# Altium project xDAC-v3.PrjPcb (part 4 of 7)

## Sheet TEC_CONTROLLER_1.SchDoc: Laser PCB
size A3; DrawnBy: James Singleton; Organization: TMC Technology Ltd.; DocumentNumber: 11; Revision: A; SheetNumber: 10; SheetTotal: 18; Drawn Date: 22/12/2020
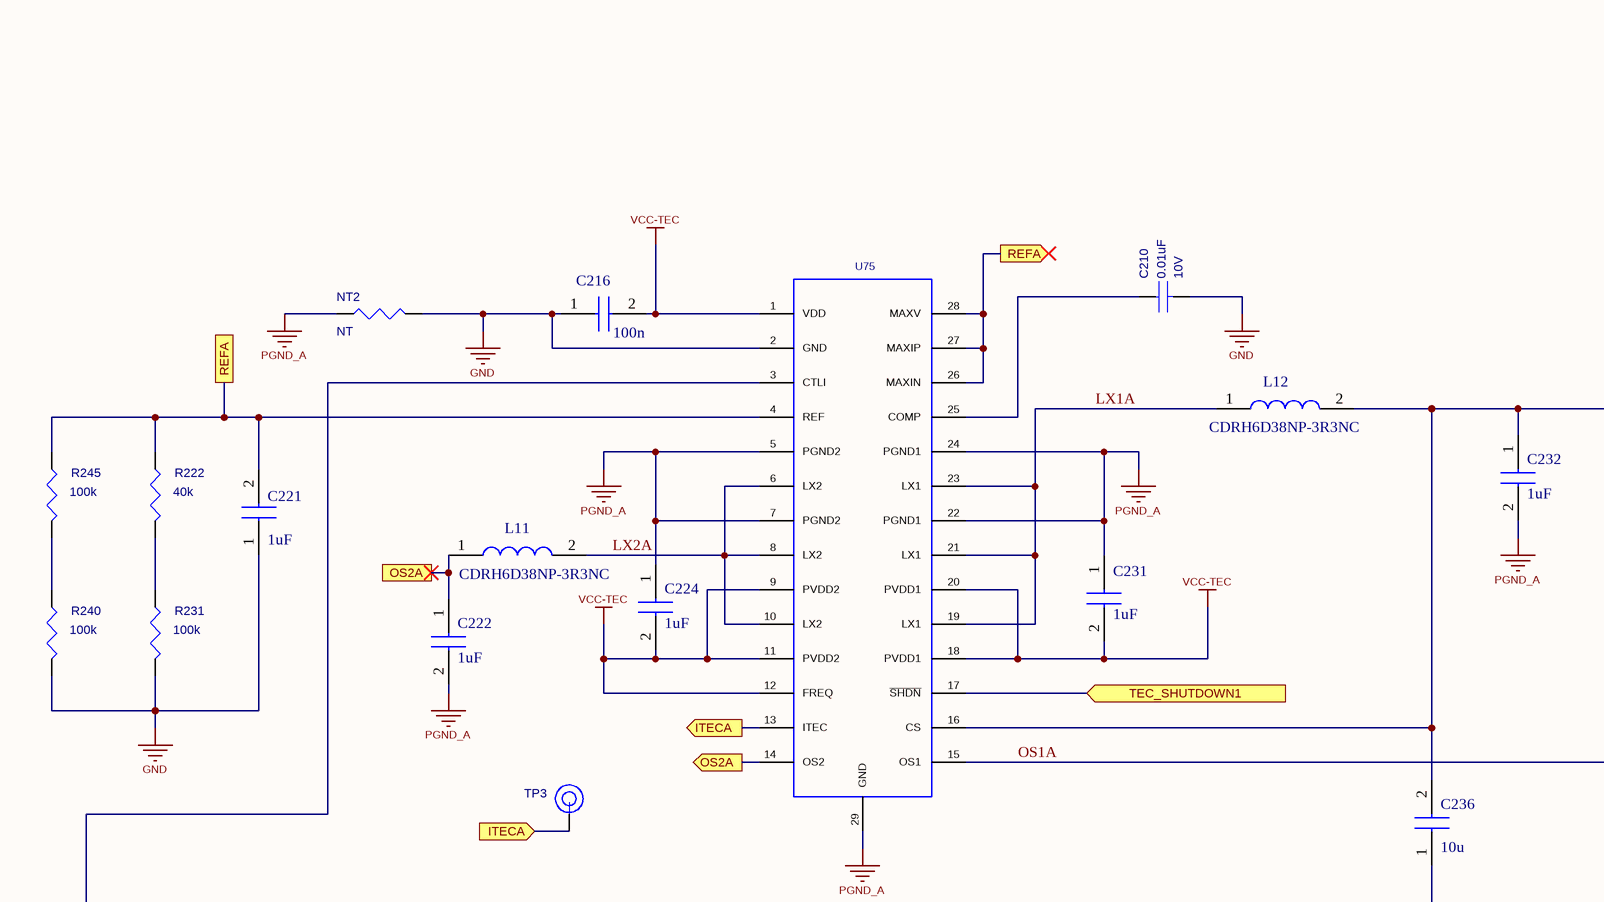
[diagram p11: TEC_CONTROLLER_1.SchDoc, top left]
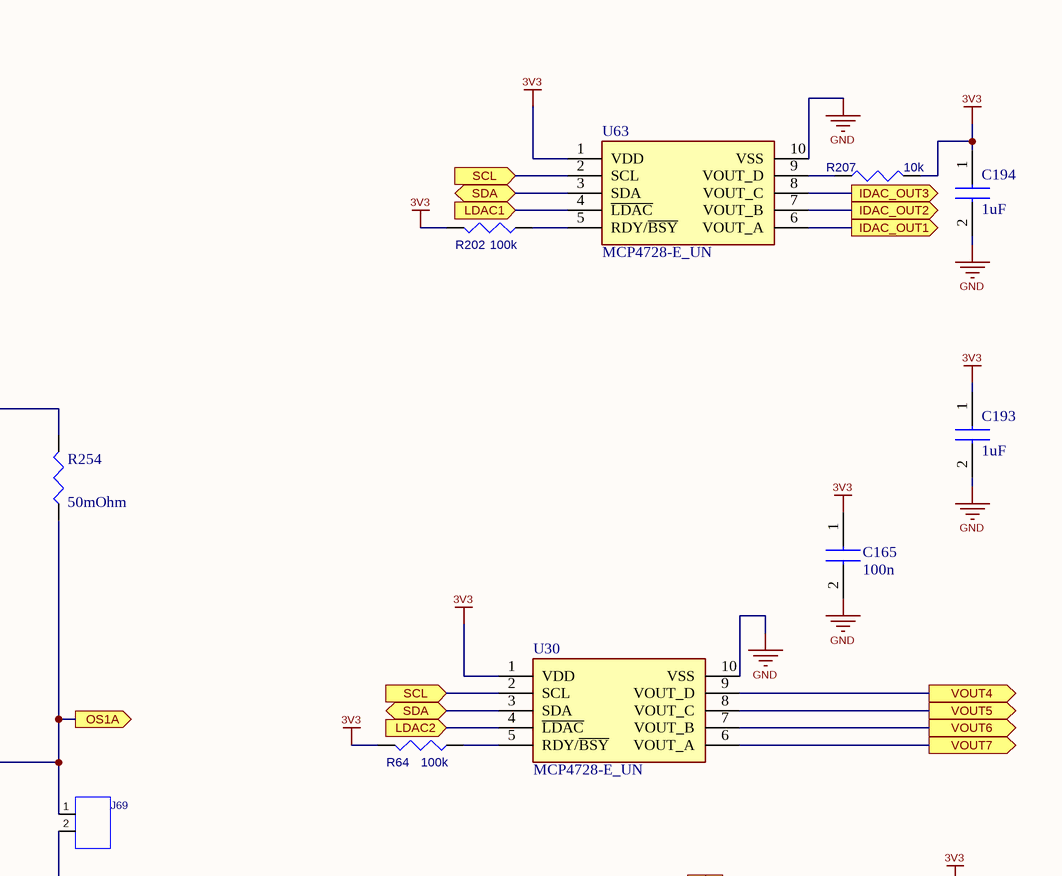
[diagram p12: TEC_CONTROLLER_1.SchDoc, top right]
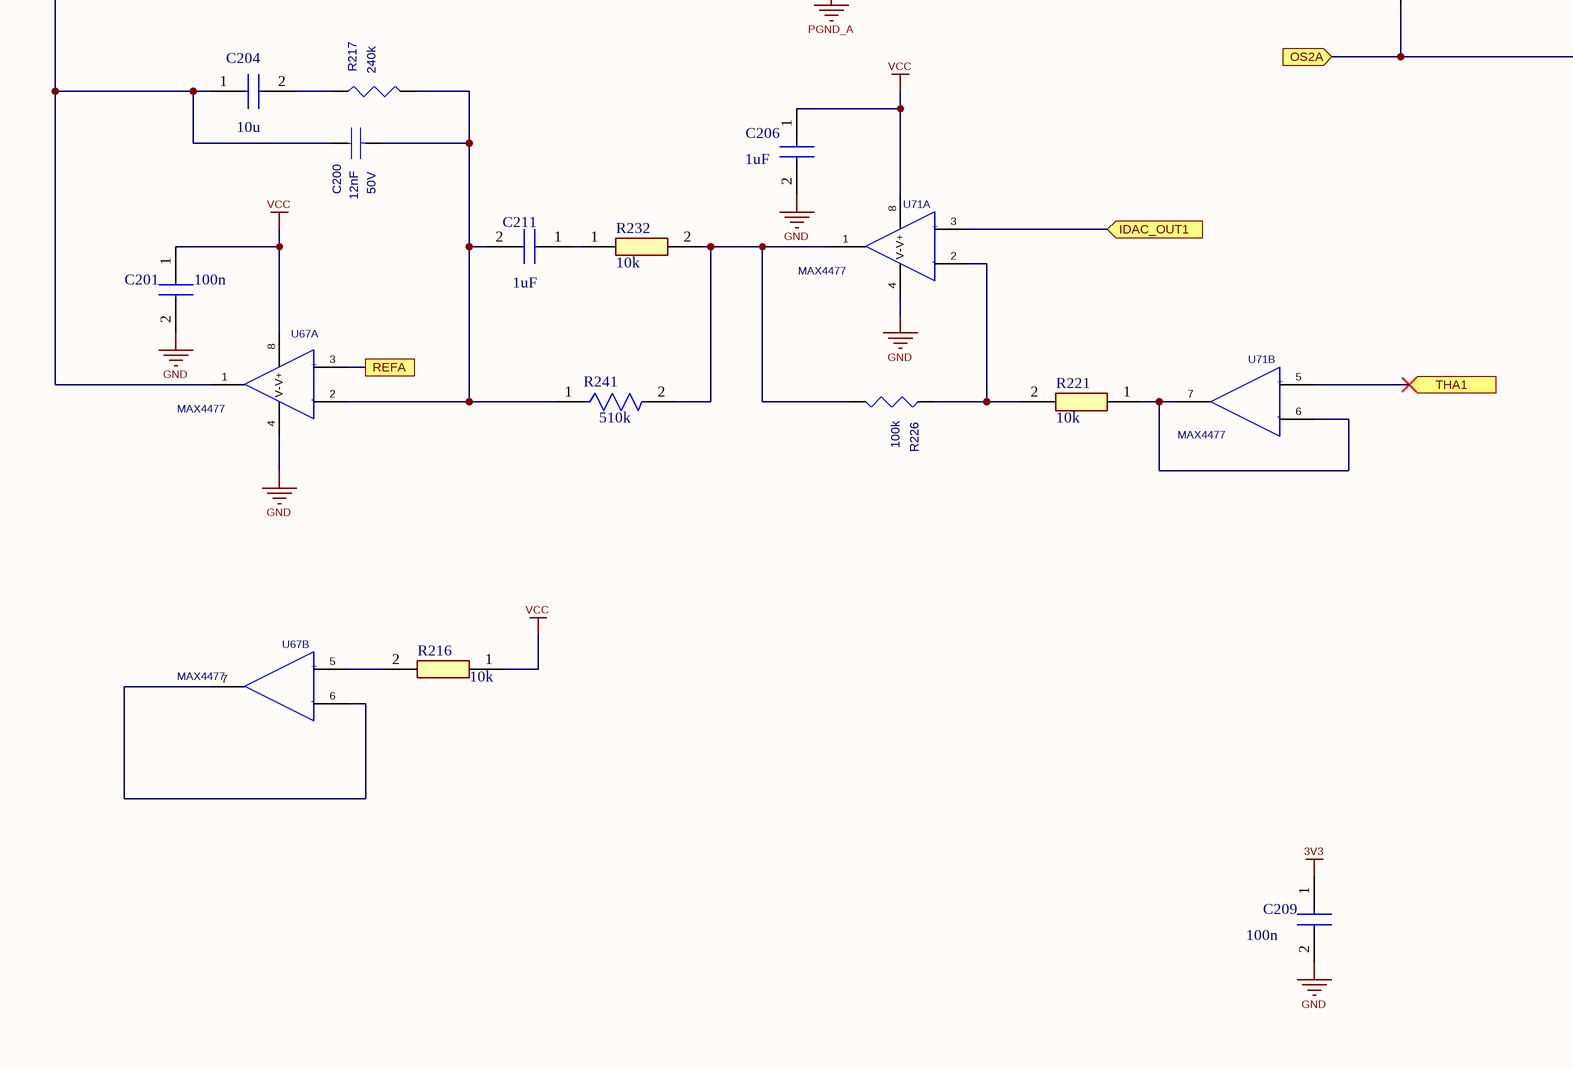
[diagram p13: TEC_CONTROLLER_1.SchDoc, bottom left]
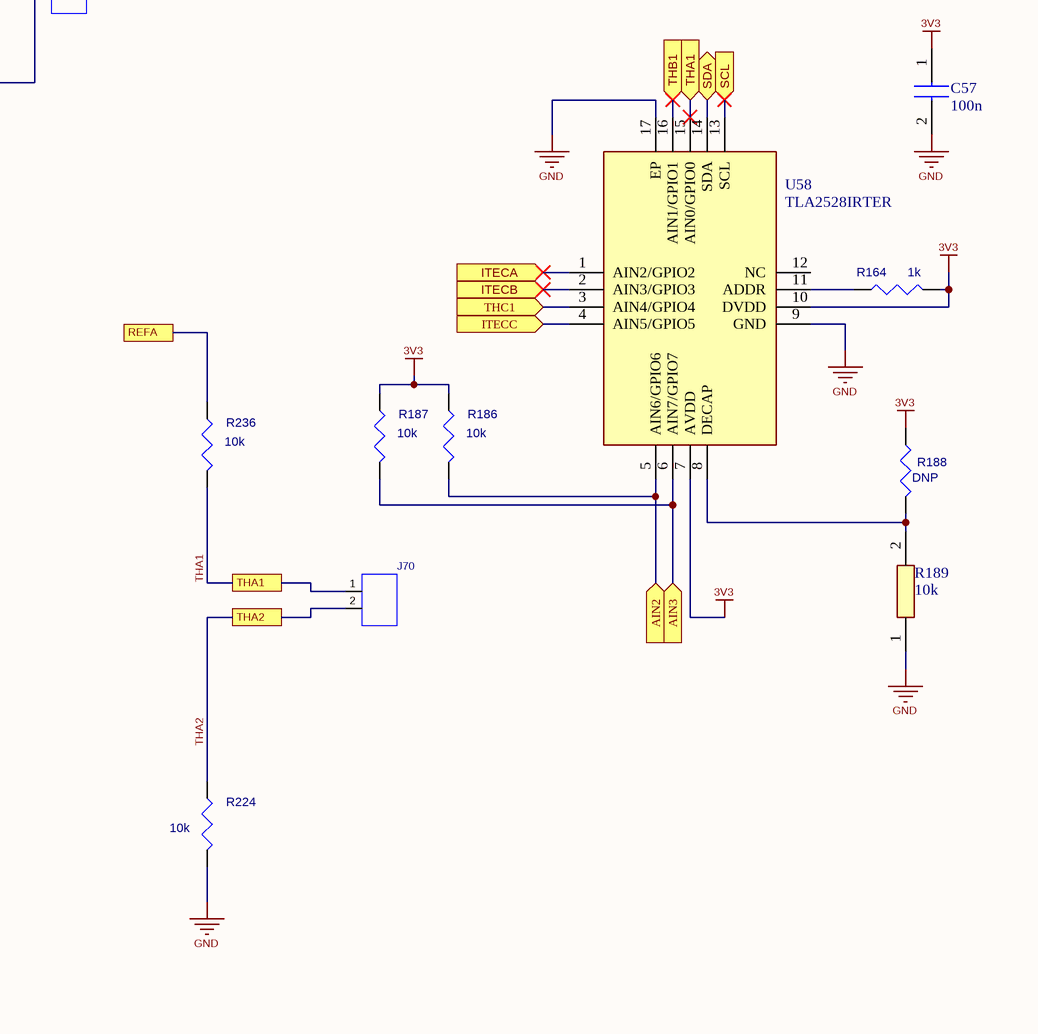
[diagram p14: TEC_CONTROLLER_1.SchDoc, bottom right]

### Parts
C57  100n  [CAPC1608X90N]
C165  100n  [CAPC1608X90N]
C193  1uF  [CAPC1608X95N]
C194  1uF  [CAPC1608X95N]
C200  value 12nF  Rated_Voltage: 50V  [CC0603N]  (hidden comment: 12n)
C201  100n  [CAPC1608X90N]
C204  10u  [CAPC1608X90N]
C206  1uF  [CAPC1608X95N]
C209  100n  [CAPC1608X90N]
C210  value 0.01uF  Rated_Voltage: 10V  [CC0603N]  (hidden comment: 10n)
C211  1uF  [CAPC1608X95N]
C216  100n  [CAPC1608X90N]
C221  1uF  [CAPC1608X95N]
C222  1uF  [CAPC1608X95N]
C224  1uF  [CAPC1608X95N]
C231  1uF  [CAPC1608X95N]
C232  1uF  [CAPC1608X95N]
C236  10u  [CAPC1608X90N]
J69  CON02  [AE-6410-2W-VERTICAL]  (value not drawn)
J70  CON02  [AE-6410-2W-VERTICAL]  (value not drawn)
L11  CDRH6D38NP-3R3NC  [CDRH6D38NP3R3NC]
L12  CDRH6D38NP-3R3NC  [CDRH6D38NP3R3NC]
NT2  value NT  [NetTie]  (hidden comment: Net Tie)  (net tie, no BOM)
R64  100k  [CR0603N]
R164  1k  [CR0603N]
R186  value 10k  [CR0603N]  (hidden comment: RES)
R187  value 10k  [CR0603N]  (hidden comment: RES)
R188  DNP  [CR0603N]
R189  10k  [RESC1608X55N]
R202  100k  [CR0603N]
R207  value 10k  [CR0603N]  (hidden comment: RES)
R216  10k  [RESC1608X55N]
R217  240k  [CR0603N]
R221  10k  [RESC1608X55N]
R222  40k  [CR0603N]
R224  value 10k  [CR0603N]  (hidden comment: RES)
R226  100k  [CR0603N]
R231  100k  [CR0603N]
R232  10k  [RESC1608X55N]
R236  value 10k  [CR0603N]  (hidden comment: RES)
R240  100k  [CR0603N]
R241  Resistance: 510k  [FP-CR0603-MFG]  (hidden comment: CR0603-JW-514ELF)
R245  100k  [CR0603N]
R254  value 50mOhm  [RESC3216X89N]  (hidden comment: PE1206FRE470R05L)
TP3  DNP  [MILLMAX3210]  (value not drawn)
U30  MCP4728-E_UN  [SOP50P490X110-10N]
U58  TLA2528IRTER  [QFN50P300X300X80-17N-D]
U63  MCP4728-E_UN  [SOP50P490X110-10N]
U67  MAX4477  [SOP65P490X110-8CN]  (parts A,B of 2)
U71  MAX4477  [SOP65P490X110-8CN]  (parts A,B of 2)
U75  (no value)  [SOP65P638X110-29N]

### Ports
AIN2 (in), AIN3 (in), IDAC_OUT1 (in, see TEC_CONTROLLER_1[8A]), IDAC_OUT1 (out, see TEC_CONTROLLER_1[4C]), IDAC_OUT2 (out, see TEC_CONTROLLER_2[4C]), IDAC_OUT3 (out, see TEC_CONTROLLER_3[4C]), ITECA (in, see TEC_CONTROLLER_1[2B], TEC_CONTROLLER_1[3B]), ITECA (in, see TEC_CONTROLLER_1[3B], TEC_CONTROLLER_1[7C]), ITECA (out, see TEC_CONTROLLER_1[2B], TEC_CONTROLLER_1[7C]), ITECB (in, see TEC_CONTROLLER_2[2B], TEC_CONTROLLER_2[3B]), ITECC (in, see TEC_CONTROLLER_3[2B], TEC_CONTROLLER_3[3B]), LDAC1 (in, see PI_INTERFACE[3A]), LDAC2 (in, see PI_INTERFACE[3A]), OS1A (out), OS2A (in, see TEC_CONTROLLER_1[2B], TEC_CONTROLLER_1[3B]), OS2A (out, see TEC_CONTROLLER_1[2B], TEC_CONTROLLER_1[5B]), OS2A (see TEC_CONTROLLER_1[3B], TEC_CONTROLLER_1[5B]), REFA (out, see TEC_CONTROLLER_1[1A], TEC_CONTROLLER_1[2C], TEC_CONTROLLER_1[6C]), REFA (see TEC_CONTROLLER_1[1A], TEC_CONTROLLER_1[2C], TEC_CONTROLLER_1[4A]), REFA (see TEC_CONTROLLER_1[1A], TEC_CONTROLLER_1[4A], TEC_CONTROLLER_1[6C]), REFA (see TEC_CONTROLLER_1[2C], TEC_CONTROLLER_1[4A], TEC_CONTROLLER_1[6C]), SCL (in, see ADC-DAC[2C], ADC-DAC[3A], ADC-DAC[4B], ADC-DAC[4C], ADC-DAC[5C], ADC-DAC[6A], Fan & Power Out[6A], PI_INTERFACE[3A], TEC_CONTROLLER_1[6B], TEC_CONTROLLER_1[7A]), SCL (in, see ADC-DAC[2C], ADC-DAC[3A], ADC-DAC[4B], ADC-DAC[4C], ADC-DAC[5C], ADC-DAC[6A], Fan & Power Out[6A], PI_INTERFACE[3A], TEC_CONTROLLER_1[6B], TEC_CONTROLLER_1[8B]), SCL (in, see ADC-DAC[2C], ADC-DAC[3A], ADC-DAC[4B], ADC-DAC[4C], ADC-DAC[5C], ADC-DAC[6A], Fan & Power Out[6A], PI_INTERFACE[3A], TEC_CONTROLLER_1[7A], TEC_CONTROLLER_1[8B]), SDA (bidir, see ADC-DAC[2C], ADC-DAC[3A], ADC-DAC[4B], ADC-DAC[4C], ADC-DAC[5C], ADC-DAC[6A], Fan & Power Out[6A], PI_INTERFACE[3A], TEC_CONTROLLER_1[6B], TEC_CONTROLLER_1[7A]), SDA (bidir, see ADC-DAC[2C], ADC-DAC[3A], ADC-DAC[4B], ADC-DAC[4C], ADC-DAC[5C], ADC-DAC[6A], Fan & Power Out[6A], PI_INTERFACE[3A], TEC_CONTROLLER_1[6B], TEC_CONTROLLER_1[7B]), SDA (bidir, see ADC-DAC[2C], ADC-DAC[3A], ADC-DAC[4B], ADC-DAC[4C], ADC-DAC[5C], ADC-DAC[6A], Fan & Power Out[6A], PI_INTERFACE[3A], TEC_CONTROLLER_1[7A], TEC_CONTROLLER_1[7B]), TEC_SHUTDOWN1 (in, see PIO[2C]), THA1 (in, see TEC_CONTROLLER_1[5C], TEC_CONTROLLER_1[6C]), THA1 (in, see TEC_CONTROLLER_1[6C], TEC_CONTROLLER_1[7B]), THA1 (see TEC_CONTROLLER_1[5C], TEC_CONTROLLER_1[7B]), THA2, THB1 (in, see TEC_CONTROLLER_2[5C], TEC_CONTROLLER_2[6D]), THC1 (in, see TEC_CONTROLLER_3[5C], TEC_CONTROLLER_3[6D]), VOUT4 (out, see LIM+LEDS+POWER[1A]), VOUT5 (out, see LIM+LEDS+POWER[1B]), VOUT6 (out, see LIM+LEDS+POWER[1C]), VOUT7 (out, see LIM+LEDS+POWER[1C])

### Nets
3V3: C57.1 C165.1 C193.1 C194.1 C209.1 R64.1 R164.2 R186.1 R187.1 R188.1 R202.1 R207.2 U30.1(VDD) U58.7(AVDD) U58.10(DVDD) U63.1(VDD)
GND: C57.2 C165.2 C193.2 C194.2 C201.2 C206.2 C209.2 C210.2 C216.1 C221.1 NT2.1 R189.1 R224.2 R231.2 R240.2 U30.10(VSS) U58.9(GND) U58.17(EP) U63.10(VSS) U67.4(V-) U71.4(V-) U75.2(GND)
PGND_A: C222.2 C224.1 C231.1 C232.2 NT2.2 U75.5(PGND2) U75.7(PGND2) U75.22(PGND1) U75.24(PGND1) U75.29(GND)
VCC: C201.1 C206.1 R216.1 U67.8(V+) U71.8(V+)
VCC-TEC: C216.2 C224.2 C231.2 U75.1(VDD) U75.9(PVDD2) U75.11(PVDD2) U75.12(FREQ) U75.18(PVDD1) U75.20(PVDD1)
AIN2: R186.2 U58.5(AIN6/GPIO6) ; port AIN2
AIN3: R187.2 U58.6(AIN7/GPIO7) ; port AIN3
IDAC_OUT1: U63.6(VOUT_A) U71.3 ; port IDAC_OUT1
IDAC_OUT2: U63.7(VOUT_B) ; port IDAC_OUT2
IDAC_OUT3: U63.8(VOUT_C) ; port IDAC_OUT3
ITECA: TP3.1 U58.1(AIN2/GPIO2) U75.13(ITEC) ; port ITECA
ITECB: U58.2(AIN3/GPIO3) ; port ITECB
ITECC: U58.4(AIN5/GPIO5) ; port ITECC
LDAC1: U63.4(~{LDAC}) ; port LDAC1
LDAC2: U30.4(~{LDAC}) ; port LDAC2
LX1A: L12.1 U75.19(LX1) U75.21(LX1) U75.23(LX1)
LX2A: L11.2 U75.6(LX2) U75.8(LX2) U75.10(LX2)
OS1A: J69.1 R254.1 U75.15(OS1) ; port OS1A
OS2A: C222.1 C236.1 J69.2 L11.1 U75.14(OS2) ; port OS2A
REFA: C221.2 R222.1 R236.1 R245.1 U67.3 U75.4(REF) U75.26(MAXIN) U75.27(MAXIP) U75.28(MAXV) ; port REFA
SCL: U30.2(SCL) U58.13(SCL) U63.2(SCL) ; port SCL
SDA: U30.3(SDA) U58.14(SDA) U63.3(SDA) ; port SDA
TEC_SHUTDOWN1: U75.17(~{SHDN}) ; port TEC_SHUTDOWN1
THA1: J70.1 R236.2 U58.15(AIN0/GPIO0) U71.5 ; port THA1
THA2: J70.2 R224.1 ; port THA2
THB1: U58.16(AIN1/GPIO1) ; port THB1
THC1: U58.3(AIN4/GPIO4) ; port THC1
VOUT4: U30.9(VOUT_D) ; port VOUT4
VOUT5: U30.8(VOUT_C) ; port VOUT5
VOUT6: U30.7(VOUT_B) ; port VOUT6
VOUT7: U30.6(VOUT_A) ; port VOUT7
NetC200_1: C200.1 C204.1 U67.1 U75.3(CTLI)
NetC200_2: C200.2 C211.2 R217.2 R241.1 U67.2
NetC204_2: C204.2 R217.1
NetC210_1: C210.1 U75.25(COMP)
NetC211_1: C211.1 R232.1
NetC232_1: C232.1 C236.2 L12.2 R254.2 U75.16(CS)
NetR64_2: R64.2 U30.5(RDY/~{BSY})
NetR164_1: R164.1 U58.11(ADDR)
NetR188_2: R188.2 R189.2 U58.8(DECAP)
NetR202_2: R202.2 U63.5(RDY/~{BSY})
NetR207_1: R207.1 U63.9(VOUT_D)
NetR216_2: R216.2 U67.5
NetR221_1: R221.1 U71.6 U71.7
NetR221_2: R221.2 R226.1 U71.2
NetR222_2: R222.2 R231.1
NetR226_2: R226.2 R232.2 R241.2 U71.1
NetR240_1: R240.1 R245.2
NetU67_6: U67.6 U67.7

Not connected (* = marked no-connect by the designer): U58 12(NC)

### Notes on the sheet
- TMC Technology Ltd.
- Page Contents:
- Project:
- Variant:
- Checked By:
- Size:
- Date:
- Dwg No:
- Sheet
- of
- Revision:
- (in symbol MAX4477, part A) +; -
- (in symbol MAX4477, part B) +; -

### Library data of the parts
C57 C165 C201 C209 C216 = CL10B104KB85PNC: Capacitor; Manufacturer_Name: SAMSUNG; Datasheet Link: https://product.samsungsem.com/mlcc/CL10B104KB85PN.do; Height: 0.9mm; Manufacturer_Part_Number: CL10B104KB85PNC; Mouser Part Number: 187-CL10B104KB85PNC; Mouser Price/Stock: https://www.mouser.co.uk/ProductDetail/Samsung-Electro-Mechanics/CL10B104KB85PNC?qs=349EhDEZ59rqeQxdKfSn5w%3D%3D; Arrow Part Number: CL10B104KB85PNC; Arrow Price/Stock: https://www.arrow.com/en/products/cl10b104kb85pnc/samsung-electro-mechanics
  C201 C209 C216: ClassName: TEC1
C193 C194 C206 C211 C221 C222 C224 C231 C232 = CL10B105KB8NQNC: Capacitor; Manufacturer_Name: SAMSUNG; Datasheet Link: https://product.samsungsem.com/mlcc/CL10B105KB8NQN.do; Height: 0.95mm; Manufacturer_Part_Number: CL10B105KB8NQNC; Mouser Part Number: 187-CL10B105KB8NQNC; Mouser Price/Stock: https://www.mouser.co.uk/ProductDetail/Samsung-Electro-Mechanics/CL10B105KB8NQNC?qs=Jm2GQyTW%2FbjBq1uiSyA2AQ%3D%3D; Arrow Part Number: CL10B105KB8NQNC; Arrow Price/Stock: https://www.arrow.com/en/products/cl10b105kb8nqnc/samsung-electro-mechanics?region=europe
  C206 C211 C221 C222 C224 C231 C232: ClassName: TEC1
C200 = CAP: Cap., 0.012µF ±10% 50V Ceramic X7R 0603 (1608 Metric); PART_NUMBER: 478-1228-1-ND; Manufacturer: AVX; Manufacturer_PN: 06035C123KAT2A; FPLIST: CC0603N,CC0603L,CC0603M; Dielectric_Type: X5R; CLASS: DISCRETE; Source_Path: \\MIL-NS1\CIP\SCHEMATIC_SYMBOLS\LTC_CAPACITOR.OLB; Geometry.Height: 37.40mil; Package_Size: 0603; Package_Type: SMD; Tolerance: 10%; PCB DECAL: CC0603N; ClassName: TEC1
C204 C236 = GRM188Z71A106MA73J: Capacitor; Manufacturer_Name: Murata Electronics; Value: 10uF; Datasheet Link: http://componentsearchengine.com/Datasheets/1/GRM188Z71A106MA73J.pdf; Height: 0.9mm; Manufacturer_Part_Number: GRM188Z71A106MA73J; Mouser Part Number: 81-GRM188Z71A106MA3J; Mouser Price/Stock: https://www.mouser.com/Search/Refine.aspx?Keyword=81-GRM188Z71A106MA3J; Arrow Part Number: GRM188Z71A106MA73J; Arrow Price/Stock: https://www.arrow.com/en/products/grm188z71a106ma73j/murata-manufacturing; ClassName: TEC1
C210 = CAP: CAP.,0.01uF,X5R,10V,10%,0603; Manufacturer_PN: 0603ZD103KAT2A; Manufacturer: AVX; CLASS: DISCRETE; FPLIST: CC0603N,CC0603L,CC0603M; Source_Path: \\MIL-NS1\CIP\SCHEMATIC_SYMBOLS\LTC_CAPACITOR.OLB; Geometry.Height: 37.40mil; Tolerance: 10%; Dielectric_Type: X5R; Package_Size: 0603; PCB DECAL: CC0603N; ClassName: TEC1
J69 J70 = CON02: 2 pin Connector; Manufacturer: Molex; UNNAMED1: DNF; Order No: 1360130; PCB DECAL: AE-6410-2W-VERTICAL; Part No: 22-29-2021; ClassName: TEC1
  J70: System: Connector
L11 L12 = CDRH6D38NP-3R3NC: Inductor; Manufacturer_Name: Sumida; Datasheet Link: http://products.sumida.com/products/pdf/CDRH6D38.pdf; Manufacturer_Part_Number: CDRH6D38NP-3R3NC; Mouser Part Number: 851-CDRH6D38NP-3R3NC; Mouser Price/Stock: https://www.mouser.co.uk/ProductDetail/Sumida/CDRH6D38NP-3R3NC?qs=yEEOfDmvQDXre4MvBRE7jQ%3D%3D; Arrow Part Number: CDRH6D38NP-3R3NC; Arrow Price/Stock: https://www.arrow.com/en/products/cdrh6d38np-3R3nc/sumida?region=nac; Height: 4mm
NT2 = NetTie: Manufacturer_PN: ERJ3EKF1002V; Manufacturer: PANASONIC; Part No: P10.0KHCT-ND; PCB DECAL: CR0603N; CLASS: DISCRETE; Rated_Power: 1/10W; Tolerance: 1%; Temperature_Coefficient: 100ppm/C; FPLIST: CR0603N,CR0603L,CR0603M; Source_Path: \\MIL-NS1\CIP\SCHEMATIC_SYMBOLS\LTC_RESISTOR.OLB; Geometry.Height: 37.40mil; Package_Size: 0603
R64 R202 R226 R231 R240 R245 = RES: RES.,100k OHMS,1%,1/10W,0603; Manufacturer_PN: ERJ3EKF1003V; Manufacturer: PANASONIC; PART_NUMBER: P100KHCT-ND; CLASS: DISCRETE; Temperature_Coefficient: 100ppm/C; FPLIST: CR0603N,CR0603L,CR0603M; Source_Path: \\MIL-NS1\CIP\SCHEMATIC_SYMBOLS\LTC_RESISTOR.OLB; Geometry.Height: 37.40mil; PCB DECAL: CR0603N; Rated_Power: 1/10W; Tolerance: 1%; Package_Size: 0603; Value: 100k
  R226 R231 R240 R245: ClassName: TEC1
R164 = RES: RES.,1k OHMS,1%,1/10W,0603; Manufacturer_PN: ERJ3EKF1001V; Manufacturer: PANASONIC; PART_NUMBER: P1.0KHCT-ND; CLASS: DISCRETE; Temperature_Coefficient: 100ppm/C; FPLIST: CR0603N,CR0603L,CR0603M; Source_Path: \\MIL-NS1\CIP\SCHEMATIC_SYMBOLS\LTC_RESISTOR.OLB; Geometry.Height: 37.40mil; PCB DECAL: CR0603N; Rated_Power: 1/10W; Tolerance: 1%; Package_Size: 0603; Value: 1k
R186 R187 R207 R224 R236 = RES: RES.,10k OHMS,1%,1/10W,0603; Manufacturer_PN: ERJ3EKF1002V; Manufacturer: PANASONIC; Part No: P10.0KHCT-ND; CLASS: DISCRETE; Temperature_Coefficient: 100ppm/C; FPLIST: CR0603N,CR0603L,CR0603M; Source_Path: \\MIL-NS1\CIP\SCHEMATIC_SYMBOLS\LTC_RESISTOR.OLB; Geometry.Height: 37.40mil; PCB DECAL: CR0603N; Rated_Power: 1/10W; Tolerance: 1%; Package_Size: 0603
  R186 R187 R224 R236: ClassName: TEC1
R188 = RES_1: RES.,10k OHMS,1%,1/10W,0603; Manufacturer_PN: ERJ3EKF1002V; Manufacturer: PANASONIC; Part No: P10.0KHCT-ND; CLASS: DISCRETE; Temperature_Coefficient: 100ppm/C; FPLIST: CR0603N,CR0603L,CR0603M; Source_Path: \\MIL-NS1\CIP\SCHEMATIC_SYMBOLS\LTC_RESISTOR.OLB; Geometry.Height: 37.40mil; PCB DECAL: CR0603N; Rated_Power: 1/10W; Tolerance: 1%; Package_Size: 0603; Value: DNP
R189 R216 R221 R232 = CR0603-JW-103ELF: Resistor; Manufacturer_Name: Bourns; Datasheet Link: https://www.bourns.com/pdfs/chpreztr.pdf; Height: 0.55mm; Manufacturer_Part_Number: CR0603-JW-103ELF; Mouser Part Number: 652-CR0603-JW-103ELF; Mouser Price/Stock: https://www.mouser.co.uk/ProductDetail/Bourns/CR0603-JW-103ELF?qs=tprK%2FdUq6q6vORSl%252Bpo4rg%3D%3D; Arrow Part Number: CR0603-JW-103ELF; Arrow Price/Stock: https://www.arrow.com/en/products/cr0603-jw-103elf/bourns?utm_currency=USD&region=nac
R217 = RES: RES.,240k OHMS,1%,1/10W,0603; Manufacturer: PANASONIC; CLASS: DISCRETE; Temperature_Coefficient: 100ppm/C; FPLIST: CR0603N,CR0603L,CR0603M; Source_Path: \\MIL-NS1\CIP\SCHEMATIC_SYMBOLS\LTC_RESISTOR.OLB; Geometry.Height: 37.40mil; PCB DECAL: CR0603N; Rated_Power: 1/10W; Tolerance: 1%; Package_Size: 0603; Value: 240k; ClassName: TEC1
R222 = RES: RES.,40k OHMS,1%,1/10W,0603; Manufacturer_PN: CRCW0603560KFKEA; Manufacturer: VISHAY; PART_NUMBER: 2138575; CLASS: DISCRETE; Temperature_Coefficient: 100ppm/C; FPLIST: CR0603N,CR0603L,CR0603M; Source_Path: \\MIL-NS1\CIP\SCHEMATIC_SYMBOLS\LTC_RESISTOR.OLB; Geometry.Height: 37.40mil; PCB DECAL: CR0603N; Rated_Power: 1/10W; Tolerance: 1%; Package_Size: 0603; Value: 40k; ClassName: TEC1
R241 = CMP-07231-004798-1: Thick Film Chip Resistors 0603 510kΩ 0.1W 5% 200ppm/°C; Max Power Dissipation: 100mW; Voltage Rating: 50V; Number of Terminations: 2; Radiation Hardening: No; Features: Moisture Resistant; Military Standard: Not; Width: 0.031inch; Case Code (Imperial): 0603; Tolerance: 5%; Height: 0.022inch; Min Operating Temperature: -55°C; Packaging: Tape and Reel; Case Code (Metric): 1608; Contact Plating: Tin; Mount: Surface Mount; Max Operating Temperature: 155°C; Length: 1.6mm; Temperature Coefficient: 200ppm/°C; Power Rating: 100mW; Depth: 0.8mm; Termination: SMD/SMT; Composition: Thick Film; Package Quantity: 5000; Thickness: 457um; Case/Package: 0603
R254 = PE1206FRE470R05L: Resistor; Manufacturer_Name: YAGEO; Datasheet Link: https://www.yageo.com/upload/media/product/productsearch/datasheet/rchip/PYu-PE_521_RoHS_L_10.pdf; Height: 0.89mm; Manufacturer_Part_Number: PE1206FRE470R05L; Mouser Part Number: 603-PE1206FRE470R05L; Mouser Price/Stock: https://www.mouser.co.uk/ProductDetail/YAGEO/PE1206FRE470R05L?qs=eP2BKZSCXI5fQbfM3JSqUA%3D%3D
TP3 = MILLMAX3210: TEST POINT,TURRET,0.031",MTG. HOLE; Manufacturer_PN: 3210-2-00-01-00-00-08-0; Manufacturer: MILL-MAX; PART_FIELD_01: GND; Value: TEST POINT, DNF; Source_Path: \\MIL-NS1\CIP\SCHEMATIC_SYMBOLS\LTC_HARDWARE.OLB; CLASS: IO; PCB DECAL: MILLMAX3210; ClassName: TEC1
U30 U63 = MCP4728-E_UN: Integrated Circuit; Manufacturer_Name: Microchip; Manufacturer_Part_Number: MCP4728-E/UN; Datasheet Link: http://ww1.microchip.com/downloads/en/DeviceDoc/22187E.pdf; Height: 1.1mm; Mouser Part Number: 579-MCP4728-E/UN; Mouser Price/Stock: https://www.mouser.co.uk/ProductDetail/Microchip-Technology-Atmel/MCP4728-E-UN?qs=E6wAi2XWqcP2zTenScklGA%3D%3D; Arrow Part Number: MCP4728-E/UN; Arrow Price/Stock: https://www.arrow.com/en/products/mcp4728-eun/microchip-technology?region=nac
U58 = TLA2528IRTER: Integrated Circuit; Manufacturer_Name: Texas Instruments; Datasheet Link: https://www.ti.com/lit/ds/symlink/tla2528.pdf?ts=1596615195592&ref_url=https%253A%252F%252Fwww.ti.com%252Fproduct%252FTLA2528%253Futm_source%253Dgoogle%2526utm_medium%253Dcpc%2526utm_campaign%253Dasc-null-null-gpn_en-cpc-pf-google-eu%2526utm_content%253Dt; Height: 0.8mm; Manufacturer_Part_Number: TLA2528IRTER; Mouser Part Number: 595-TLA2528IRTER; Mouser Price/Stock: https://www.mouser.co.uk/ProductDetail/Texas-Instruments/TLA2528IRTER?qs=%252B6g0mu59x7KfRzJN7APgZw%3D%3D; Arrow Part Number: TLA2528IRTER; Arrow Price/Stock: https://www.arrow.com/en/products/tla2528irter/texas-instruments?region=nac
U67 U71 = MAX4477: Manufacturer: Maxim; Part No: MAX4477AUA+; Geometry.Height: 1.1mm; Order No: 2510956; PCB DECAL: SOP65P490X110-8CN; ClassName: TEC1
U75 = MAX1968: Thermoelectric Cooler PMIC 28-TSSOP-EP; Part No: MAX1969; Manufacturer: Maxim; Geometry.Height: 1.1mm; Order No: 2514258; PCB DECAL: SOP65P638X110-29N; ClassName: TEC1

## Sheet TEC_CONTROLLER_2.SchDoc: Laser PCB
size A3; DrawnBy: James Singleton; Organization: TMC Technology Ltd.; DocumentNumber: 12; Revision: A; SheetNumber: 11; SheetTotal: 18; Drawn Date: 22/12/2020
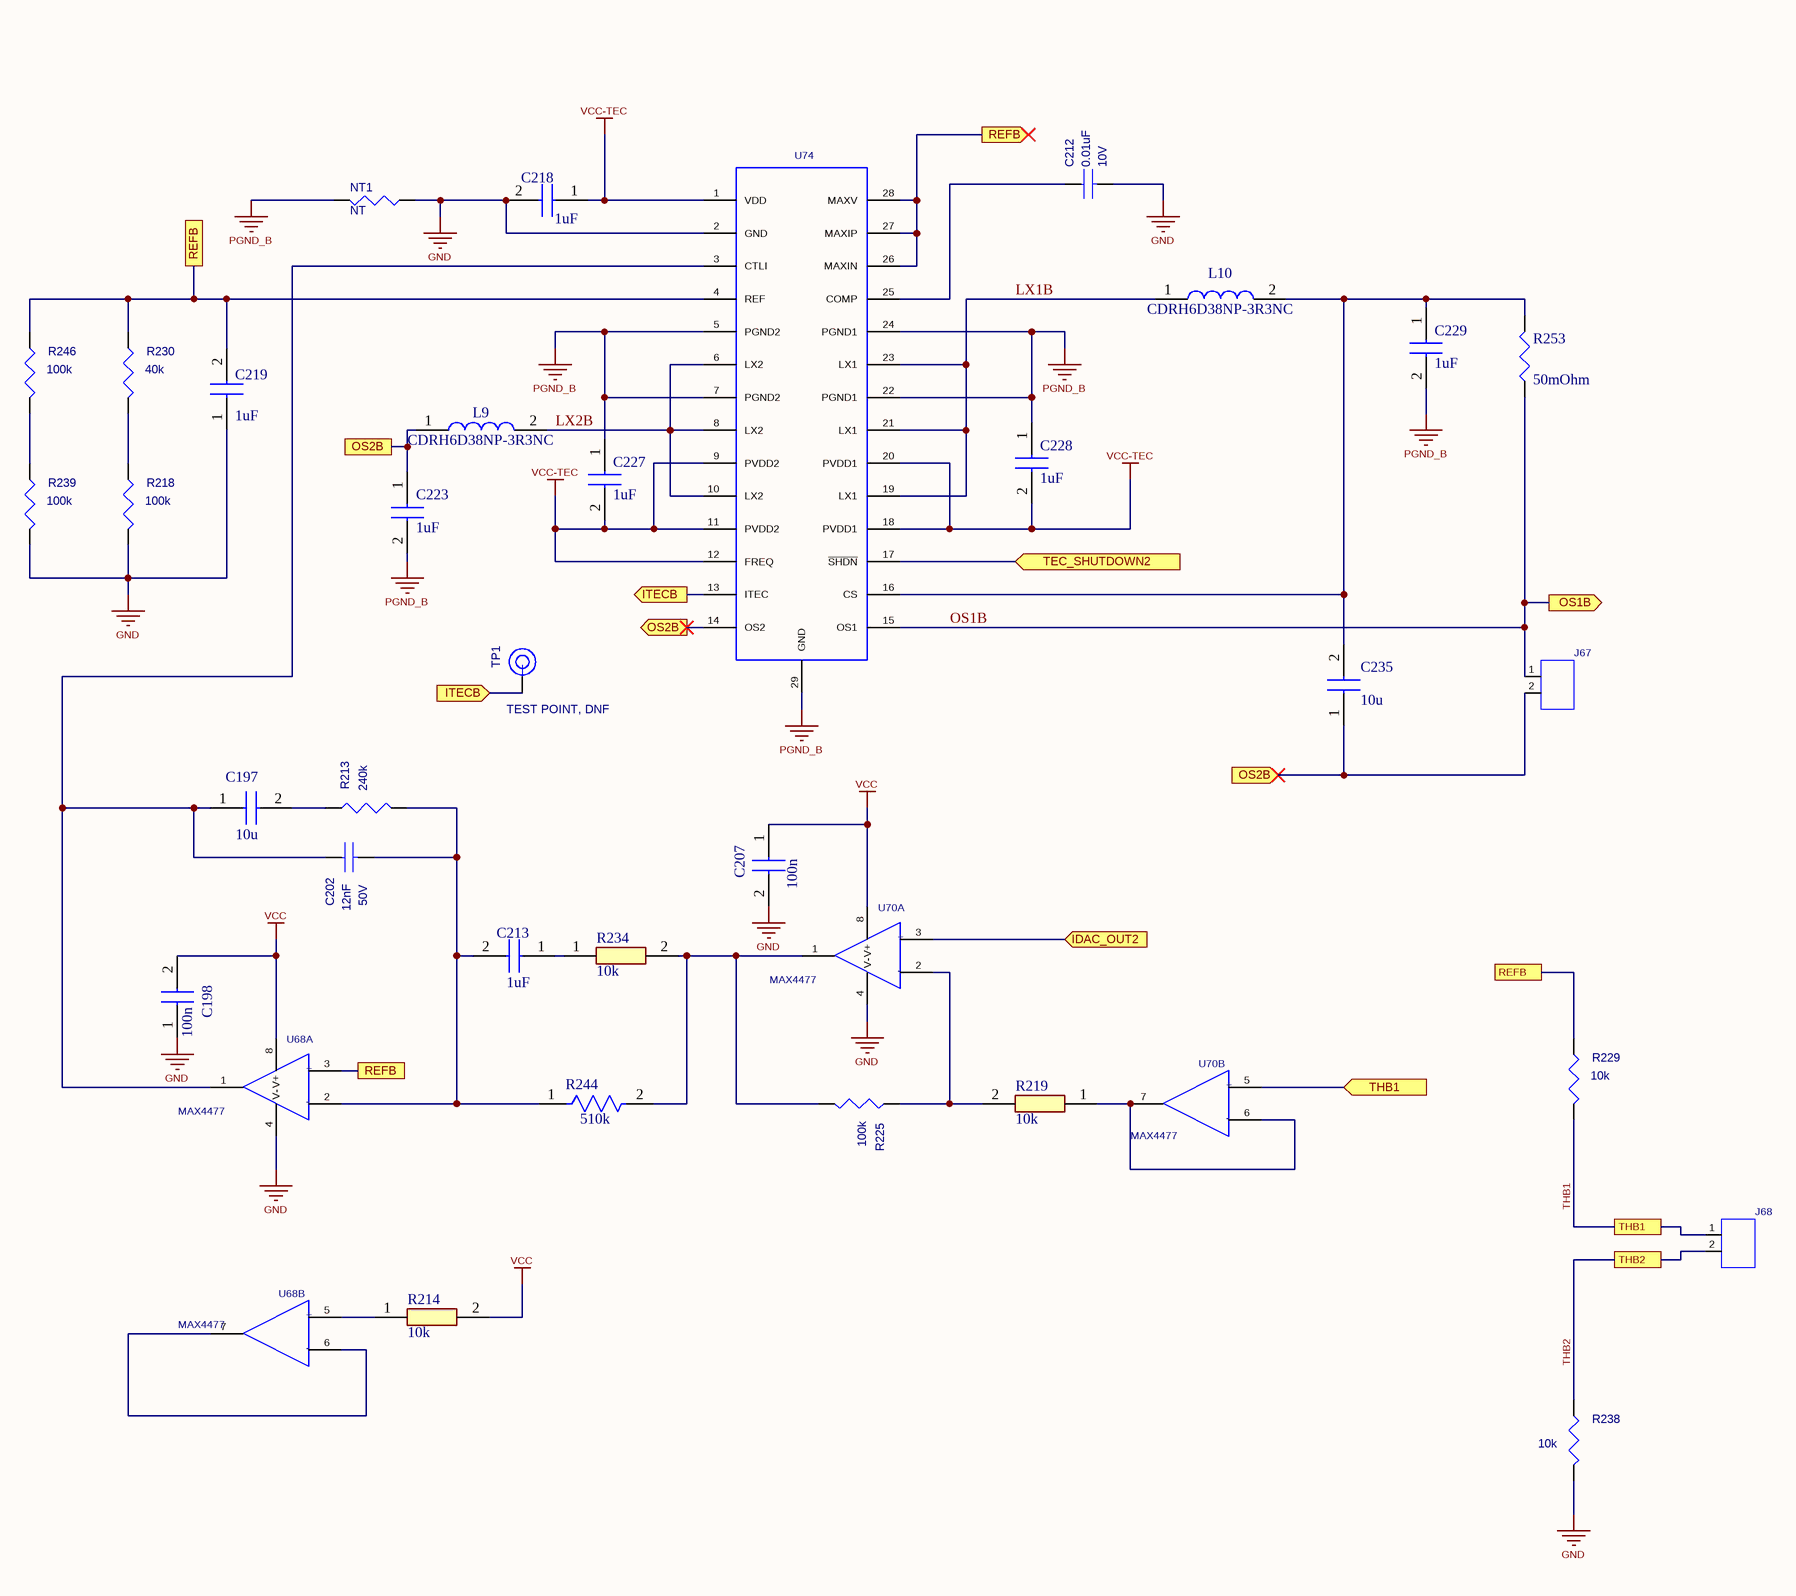
[diagram p15: TEC_CONTROLLER_2.SchDoc]

### Parts
C197  10u  [GRM18x]
C198  100n  [CAPC1608X90N]
C202  value 12nF  Rated_Voltage: 50V  [CC0603N]  (hidden comment: 12n)
C207  100n  [CAPC1608X90N]
C212  value 0.01uF  Rated_Voltage: 10V  [CC0603N]  (hidden comment: 10n)
C213  1uF  [CAPC1608X95N]
C218  1uF  [CAPC1608X95N]
C219  1uF  [CAPC1608X95N]
C223  1uF  [CAPC1608X95N]
C227  1uF  [CAPC1608X95N]
C228  1uF  [CAPC1608X95N]
C229  1uF  [CAPC1608X95N]
C235  10u  [GRM18x]
J67  CON02  [AE-6410-2W-VERTICAL]  (value not drawn)
J68  CON02  [AE-6410-2W-VERTICAL]  (value not drawn)
L9  CDRH6D38NP-3R3NC  [CDRH6D38NP3R3NC]
L10  CDRH6D38NP-3R3NC  [CDRH6D38NP3R3NC]
NT1  value NT  [NetTie]  (hidden comment: Net Tie)  (net tie, no BOM)
R213  240k  [CR0603N]
R214  10k  [RESC1608X55N]
R218  100k  [CR0603N]
R219  10k  [RESC1608X55N]
R225  100k  [CR0603N]
R229  value 10k  [CR0603N]  (hidden comment: RES)
R230  40k  [CR0603N]
R234  10k  [RESC1608X55N]
R238  value 10k  [CR0603N]  (hidden comment: RES)
R239  100k  [CR0603N]
R244  Resistance: 510k  [FP-CR0603-MFG]  (hidden comment: CR0603-JW-514ELF)
R246  100k  [CR0603N]
R253  value 50mOhm  [RESC3216X89N]  (hidden comment: PE1206FRE470R05L)
TP1  value TEST POINT, DNF  [MILLMAX3210]  (hidden comment: DNF)
U68  MAX4477  [SOP65P490X110-8CN]  (parts A,B of 2)
U70  MAX4477  [SOP65P490X110-8CN]  (parts A,B of 2)
U74  (no value)  [SOP65P638X110-29N]

### Ports
IDAC_OUT2 (in, see TEC_CONTROLLER_1[8A]), ITECB (in, see TEC_CONTROLLER_1[7C], TEC_CONTROLLER_2[3B]), ITECB (out, see TEC_CONTROLLER_1[7C], TEC_CONTROLLER_2[2B]), OS1B (out), OS2B (in, see TEC_CONTROLLER_2[2B], TEC_CONTROLLER_2[3B]), OS2B (out, see TEC_CONTROLLER_2[2B], TEC_CONTROLLER_2[5C]), OS2B (see TEC_CONTROLLER_2[3B], TEC_CONTROLLER_2[5C]), REFB (out, see TEC_CONTROLLER_2[1A], TEC_CONTROLLER_2[2C], TEC_CONTROLLER_2[5C]), REFB (see TEC_CONTROLLER_2[1A], TEC_CONTROLLER_2[2C], TEC_CONTROLLER_2[4A]), REFB (see TEC_CONTROLLER_2[1A], TEC_CONTROLLER_2[4A], TEC_CONTROLLER_2[5C]), REFB (see TEC_CONTROLLER_2[2C], TEC_CONTROLLER_2[4A], TEC_CONTROLLER_2[5C]), TEC_SHUTDOWN2 (in, see PIO[2C]), THB1 (in, see TEC_CONTROLLER_1[7B], TEC_CONTROLLER_2[6D]), THB1 (see TEC_CONTROLLER_1[7B], TEC_CONTROLLER_2[5C]), THB2

### Nets
GND: C198.1 C207.2 C212.2 C218.2 C219.1 NT1.2 R218.2 R238.2 R239.2 U68.4(V-) U70.4(V-) U74.2(GND)
PGND_B: C223.2 C227.1 C228.1 C229.2 NT1.1 U74.5(PGND2) U74.7(PGND2) U74.22(PGND1) U74.24(PGND1) U74.29(GND)
VCC: C198.2 C207.1 R214.2 U68.8(V+) U70.8(V+)
VCC-TEC: C218.1 C227.2 C228.2 U74.1(VDD) U74.9(PVDD2) U74.11(PVDD2) U74.12(FREQ) U74.18(PVDD1) U74.20(PVDD1)
IDAC_OUT2: U70.3 ; port IDAC_OUT2
ITECB: TP1.1 U74.13(ITEC) ; port ITECB
LX1B: L10.1 U74.19(LX1) U74.21(LX1) U74.23(LX1)
LX2B: L9.2 U74.6(LX2) U74.8(LX2) U74.10(LX2)
OS1B: J67.1 R253.1 U74.15(OS1) ; port OS1B
OS2B: C223.1 C235.1 J67.2 L9.1 U74.14(OS2) ; port OS2B
REFB: C219.2 R229.1 R230.1 R246.1 U68.3 U74.4(REF) U74.26(MAXIN) U74.27(MAXIP) U74.28(MAXV) ; port REFB
TEC_SHUTDOWN2: U74.17(~{SHDN}) ; port TEC_SHUTDOWN2
THB1: J68.1 R229.2 U70.5 ; port THB1
THB2: J68.2 R238.1 ; port THB2
NetC197_1: C197.1 C202.1 U68.1 U74.3(CTLI)
NetC197_2: C197.2 R213.1
NetC202_2: C202.2 C213.2 R213.2 R244.1 U68.2
NetC212_1: C212.1 U74.25(COMP)
NetC213_1: C213.1 R234.1
NetC229_1: C229.1 C235.2 L10.2 R253.2 U74.16(CS)
NetR214_1: R214.1 U68.5
NetR218_1: R218.1 R230.2
NetR219_1: R219.1 U70.6 U70.7
NetR219_2: R219.2 R225.1 U70.2
NetR225_2: R225.2 R234.2 R244.2 U70.1
NetR239_1: R239.1 R246.2
NetU68_6: U68.6 U68.7

### Notes on the sheet
- TMC Technology Ltd.
- Page Contents:
- Project:
- Variant:
- Checked By:
- Size:
- Date:
- Dwg No:
- Sheet
- of
- Revision:
- (in symbol MAX4477, part A) +; -
- (in symbol MAX4477, part B) +; -

### Library data of the parts
C197 C235 = GRM188Z71A106MA73J: Capacitor; Manufacturer_Name: Murata Electronics; Datasheet Link: https://search.murata.co.jp/Ceramy/image/img/A01X/G101/ENG/GRM188Z71A106MA73-01A.pdf; Height: 0.8mm; Manufacturer_Part_Number: GRM188Z71A106MA73J; Mouser Part Number: 81-GRM188Z71A106MA3J; Mouser Price/Stock: https://www.mouser.com/Search/Refine.aspx?Keyword=81-GRM188Z71A106MA3J; Arrow Part Number: GRM188Z71A106MA73J; Arrow Price/Stock: https://www.arrow.com/en/products/grm188z71a106ma73j/murata-manufacturing; ClassName: TEC2
C198 C207 = CL10B104KB85PNC: Capacitor; Manufacturer_Name: SAMSUNG; Datasheet Link: https://product.samsungsem.com/mlcc/CL10B104KB85PN.do; Height: 0.9mm; Manufacturer_Part_Number: CL10B104KB85PNC; Mouser Part Number: 187-CL10B104KB85PNC; Mouser Price/Stock: https://www.mouser.co.uk/ProductDetail/Samsung-Electro-Mechanics/CL10B104KB85PNC?qs=349EhDEZ59rqeQxdKfSn5w%3D%3D; Arrow Part Number: CL10B104KB85PNC; Arrow Price/Stock: https://www.arrow.com/en/products/cl10b104kb85pnc/samsung-electro-mechanics; ClassName: TEC2
C202 = CAP: as C200 on sheet TEC_CONTROLLER_1; Package_Size: 0603; Package_Type: SMD; Tolerance: 10%; PCB DECAL: CC0603N; ClassName: TEC2
C212 = CAP: as C210 on sheet TEC_CONTROLLER_1; Tolerance: 10%; Dielectric_Type: X5R; Package_Size: 0603; PCB DECAL: CC0603N; ClassName: TEC2
C213 C218 C219 C223 C227-C229 = CL10B105KB8NQNC: Capacitor; Manufacturer_Name: SAMSUNG; Datasheet Link: https://product.samsungsem.com/mlcc/CL10B105KB8NQN.do; Height: 0.95mm; Manufacturer_Part_Number: CL10B105KB8NQNC; Mouser Part Number: 187-CL10B105KB8NQNC; Mouser Price/Stock: https://www.mouser.co.uk/ProductDetail/Samsung-Electro-Mechanics/CL10B105KB8NQNC?qs=Jm2GQyTW%2FbjBq1uiSyA2AQ%3D%3D; Arrow Part Number: CL10B105KB8NQNC; Arrow Price/Stock: https://www.arrow.com/en/products/cl10b105kb8nqnc/samsung-electro-mechanics?region=europe; ClassName: TEC2
J67 J68 = CON02: as J69 on sheet TEC_CONTROLLER_1; PCB DECAL: AE-6410-2W-VERTICAL; Part No: 22-29-2021; ClassName: TEC2
  J68: System: Connector
L9 L10 = CDRH6D38NP-3R3NC: Inductor; Manufacturer_Name: Sumida; Datasheet Link: http://products.sumida.com/products/pdf/CDRH6D38.pdf; Manufacturer_Part_Number: CDRH6D38NP-3R3NC; Mouser Part Number: 851-CDRH6D38NP-3R3NC; Mouser Price/Stock: https://www.mouser.co.uk/ProductDetail/Sumida/CDRH6D38NP-3R3NC?qs=yEEOfDmvQDXre4MvBRE7jQ%3D%3D; Arrow Part Number: CDRH6D38NP-3R3NC; Arrow Price/Stock: https://www.arrow.com/en/products/cdrh6d38np-3R3nc/sumida?region=nac; Height: 4mm
NT1 = NetTie: as NT2 on sheet TEC_CONTROLLER_1; Package_Size: 0603
R213 = RES: as R217 on sheet TEC_CONTROLLER_1; PCB DECAL: CR0603N; Rated_Power: 1/10W; Tolerance: 1%; Package_Size: 0603; Value: 240k; ClassName: TEC2
R214 R219 R234 = CR0603-JW-103ELF: Resistor; Manufacturer_Name: Bourns; Datasheet Link: https://www.bourns.com/pdfs/chpreztr.pdf; Height: 0.55mm; Manufacturer_Part_Number: CR0603-JW-103ELF; Mouser Part Number: 652-CR0603-JW-103ELF; Mouser Price/Stock: https://www.mouser.co.uk/ProductDetail/Bourns/CR0603-JW-103ELF?qs=tprK%2FdUq6q6vORSl%252Bpo4rg%3D%3D; Arrow Part Number: CR0603-JW-103ELF; Arrow Price/Stock: https://www.arrow.com/en/products/cr0603-jw-103elf/bourns?utm_currency=USD&region=nac
R218 R225 R239 R246 = RES: as R64 on sheet TEC_CONTROLLER_1; PCB DECAL: CR0603N; Rated_Power: 1/10W; Tolerance: 1%; Package_Size: 0603; Value: 100k; ClassName: TEC2
R229 R238 = RES: as R186 on sheet TEC_CONTROLLER_1; PCB DECAL: CR0603N; Rated_Power: 1/10W; Tolerance: 1%; Package_Size: 0603; ClassName: TEC2
R230 = RES: as R222 on sheet TEC_CONTROLLER_1; PCB DECAL: CR0603N; Rated_Power: 1/10W; Tolerance: 1%; Package_Size: 0603; Value: 40k; ClassName: TEC2
R244 = CMP-07231-004798-1: as R241 on sheet TEC_CONTROLLER_1; Number of Terminations: 2; Radiation Hardening: No; Features: Moisture Resistant; Military Standard: Not; Width: 0.031inch; Case Code (Imperial): 0603; Tolerance: 5%; Height: 0.022inch; Min Operating Temperature: -55°C; Packaging: Tape and Reel; Case Code (Metric): 1608; Contact Plating: Tin; Mount: Surface Mount; Max Operating Temperature: 155°C; Length: 1.6mm; Temperature Coefficient: 200ppm/°C; Power Rating: 100mW; Depth: 0.8mm; Termination: SMD/SMT; Composition: Thick Film; Package Quantity: 5000; Thickness: 457um; Case/Package: 0603
R253 = PE1206FRE470R05L: Resistor; Manufacturer_Name: YAGEO; Datasheet Link: https://www.yageo.com/upload/media/product/productsearch/datasheet/rchip/PYu-PE_521_RoHS_L_10.pdf; Height: 0.89mm; Manufacturer_Part_Number: PE1206FRE470R05L; Mouser Part Number: 603-PE1206FRE470R05L; Mouser Price/Stock: https://www.mouser.co.uk/ProductDetail/YAGEO/PE1206FRE470R05L?qs=eP2BKZSCXI5fQbfM3JSqUA%3D%3D
TP1 = MILLMAX3210: TEST POINT,TURRET,0.031",MTG. HOLE; Manufacturer_PN: 3210-2-00-01-00-00-08-0; Manufacturer: MILL-MAX; PART_FIELD_01: GND; Source_Path: \\MIL-NS1\CIP\SCHEMATIC_SYMBOLS\LTC_HARDWARE.OLB; CLASS: IO; PCB DECAL: MILLMAX3210; ClassName: TEC2
U68 U70 = MAX4477: as U67 on sheet TEC_CONTROLLER_1; PCB DECAL: SOP65P490X110-8CN; ClassName: TEC2
U74 = MAX1968: as U75 on sheet TEC_CONTROLLER_1; PCB DECAL: SOP65P638X110-29N; ClassName: TEC2

## Sheet TEC_CONTROLLER_3.SchDoc: Laser PCB
size A3; DrawnBy: James Singleton; Organization: TMC Technology Ltd.; DocumentNumber: 13; Revision: A; SheetNumber: 12; SheetTotal: 18; Drawn Date: 22/12/2020
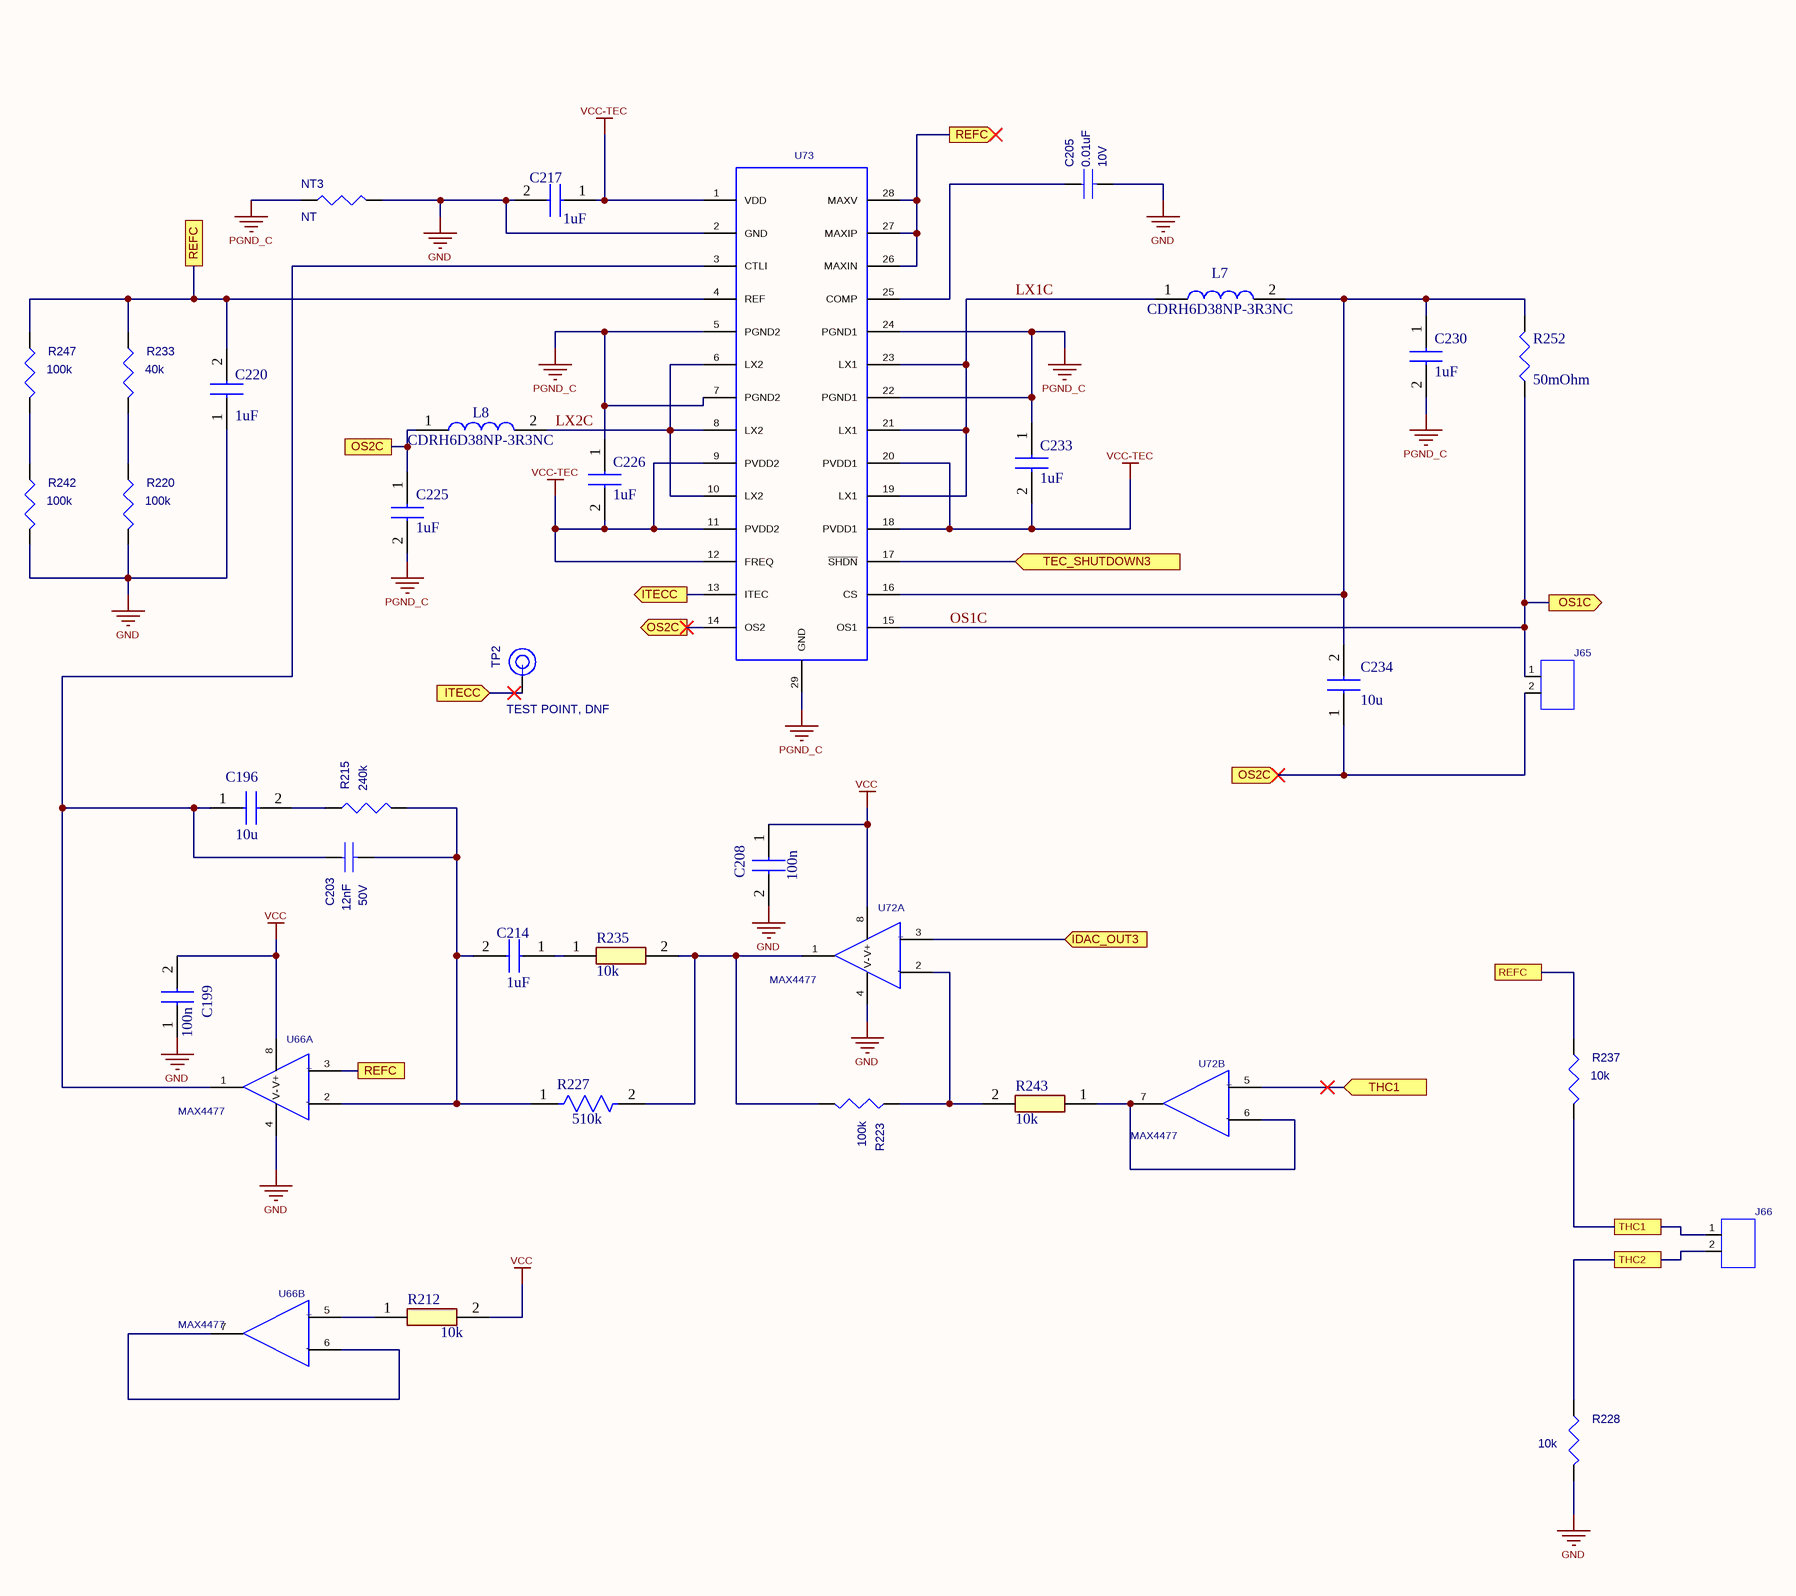
[diagram p16: TEC_CONTROLLER_3.SchDoc]

### Parts
C196  10u  [GRM18x]
C199  100n  [CAPC1608X90N]
C203  value 12nF  Rated_Voltage: 50V  [CC0603N]  (hidden comment: 12n)
C205  value 0.01uF  Rated_Voltage: 10V  [CC0603N]  (hidden comment: 10n)
C208  100n  [CAPC1608X90N]
C214  1uF  [CAPC1608X95N]
C217  1uF  [CAPC1608X95N]
C220  1uF  [CAPC1608X95N]
C225  1uF  [CAPC1608X95N]
C226  1uF  [CAPC1608X95N]
C230  1uF  [CAPC1608X95N]
C233  1uF  [CAPC1608X95N]
C234  10u  [GRM18x]
J65  CON02  [AE-6410-2W-VERTICAL]  (value not drawn)
J66  CON02  [AE-6410-2W-VERTICAL]  (value not drawn)
L7  CDRH6D38NP-3R3NC  [CDRH6D38NP3R3NC]
L8  CDRH6D38NP-3R3NC  [CDRH6D38NP3R3NC]
NT3  value NT  [NetTie]  (hidden comment: Net Tie)  (net tie, no BOM)
R212  10k  [RESC1608X55N]
R215  240k  [CR0603N]
R220  100k  [CR0603N]
R223  100k  [CR0603N]
R227  Resistance: 510k  [FP-CR0603-MFG]  (hidden comment: CR0603-JW-514ELF)
R228  value 10k  [CR0603N]  (hidden comment: RES)
R233  40k  [CR0603N]
R235  10k  [RESC1608X55N]
R237  value 10k  [CR0603N]  (hidden comment: RES)
R242  100k  [CR0603N]
R243  10k  [RESC1608X55N]
R247  100k  [CR0603N]
R252  value 50mOhm  [RESC3216X89N]  (hidden comment: PE1206FRE470R05L)
TP2  value TEST POINT, DNF  [MILLMAX3210]  (hidden comment: DNF)
U66  MAX4477  [SOP65P490X110-8CN]  (parts A,B of 2)
U72  MAX4477  [SOP65P490X110-8CN]  (parts A,B of 2)
U73  (no value)  [SOP65P638X110-29N]

### Ports
IDAC_OUT3 (in, see TEC_CONTROLLER_1[8A]), ITECC (in, see TEC_CONTROLLER_1[7C], TEC_CONTROLLER_3[3B]), ITECC (out, see TEC_CONTROLLER_1[7C], TEC_CONTROLLER_3[2B]), OS1C (out), OS2C (in, see TEC_CONTROLLER_3[2B], TEC_CONTROLLER_3[3B]), OS2C (out, see TEC_CONTROLLER_3[2B], TEC_CONTROLLER_3[5C]), OS2C (see TEC_CONTROLLER_3[3B], TEC_CONTROLLER_3[5C]), REFC (out, see TEC_CONTROLLER_3[2A], TEC_CONTROLLER_3[2C], TEC_CONTROLLER_3[6C]), REFC (see TEC_CONTROLLER_3[2A], TEC_CONTROLLER_3[2C], TEC_CONTROLLER_3[4A]), REFC (see TEC_CONTROLLER_3[2A], TEC_CONTROLLER_3[4A], TEC_CONTROLLER_3[6C]), REFC (see TEC_CONTROLLER_3[2C], TEC_CONTROLLER_3[4A], TEC_CONTROLLER_3[6C]), TEC_SHUTDOWN3 (in, see PIO[2C]), THC1 (in, see TEC_CONTROLLER_1[7C], TEC_CONTROLLER_3[6D]), THC1 (see TEC_CONTROLLER_1[7C], TEC_CONTROLLER_3[5C]), THC2

### Nets
GND: C199.1 C205.2 C208.2 C217.2 C220.1 NT3.1 R220.2 R228.2 R242.2 U66.4(V-) U72.4(V-) U73.2(GND)
PGND_C: C225.2 C226.1 C230.2 C233.1 NT3.2 U73.5(PGND2) U73.7(PGND2) U73.22(PGND1) U73.24(PGND1) U73.29(GND)
VCC: C199.2 C208.1 R212.2 U66.8(V+) U72.8(V+)
VCC-TEC: C217.1 C226.2 C233.2 U73.1(VDD) U73.9(PVDD2) U73.11(PVDD2) U73.12(FREQ) U73.18(PVDD1) U73.20(PVDD1)
IDAC_OUT3: U72.3 ; port IDAC_OUT3
ITECC: TP2.1 U73.13(ITEC) ; port ITECC
LX1C: L7.1 U73.19(LX1) U73.21(LX1) U73.23(LX1)
LX2C: L8.2 U73.6(LX2) U73.8(LX2) U73.10(LX2)
OS1C: J65.1 R252.1 U73.15(OS1) ; port OS1C
OS2C: C225.1 C234.1 J65.2 L8.1 U73.14(OS2) ; port OS2C
REFC: C220.2 R233.1 R237.1 R247.1 U66.3 U73.4(REF) U73.26(MAXIN) U73.27(MAXIP) U73.28(MAXV) ; port REFC
TEC_SHUTDOWN3: U73.17(~{SHDN}) ; port TEC_SHUTDOWN3
THC1: J66.1 R237.2 U72.5 ; port THC1
THC2: J66.2 R228.1 ; port THC2
NetC196_1: C196.1 C203.1 U66.1 U73.3(CTLI)
NetC196_2: C196.2 R215.1
NetC203_2: C203.2 C214.2 R215.2 R227.1 U66.2
NetC205_1: C205.1 U73.25(COMP)
NetC214_1: C214.1 R235.1
NetC230_1: C230.1 C234.2 L7.2 R252.2 U73.16(CS)
NetR212_1: R212.1 U66.5
NetR220_1: R220.1 R233.2
NetR223_1: R223.1 R243.2 U72.2
NetR223_2: R223.2 R227.2 R235.2 U72.1
NetR242_1: R242.1 R247.2
NetR243_1: R243.1 U72.6 U72.7
NetU66_6: U66.6 U66.7

### Notes on the sheet
- TMC Technology Ltd.
- Page Contents:
- Project:
- Variant:
- Checked By:
- Size:
- Date:
- Dwg No:
- Sheet
- of
- Revision:
- (in symbol MAX4477, part A) +; -
- (in symbol MAX4477, part B) +; -

### Library data of the parts
C196 C234 = GRM188Z71A106MA73J: as C197 on sheet TEC_CONTROLLER_2; Datasheet Link: https://search.murata.co.jp/Ceramy/image/img/A01X/G101/ENG/GRM188Z71A106MA73-01A.pdf; Height: 0.8mm; Manufacturer_Part_Number: GRM188Z71A106MA73J; Mouser Part Number: 81-GRM188Z71A106MA3J; Mouser Price/Stock: https://www.mouser.com/Search/Refine.aspx?Keyword=81-GRM188Z71A106MA3J; Arrow Part Number: GRM188Z71A106MA73J; Arrow Price/Stock: https://www.arrow.com/en/products/grm188z71a106ma73j/murata-manufacturing; ClassName: TEC3
C199 C208 = CL10B104KB85PNC: Capacitor; Manufacturer_Name: SAMSUNG; Datasheet Link: https://product.samsungsem.com/mlcc/CL10B104KB85PN.do; Height: 0.9mm; Manufacturer_Part_Number: CL10B104KB85PNC; Mouser Part Number: 187-CL10B104KB85PNC; Mouser Price/Stock: https://www.mouser.co.uk/ProductDetail/Samsung-Electro-Mechanics/CL10B104KB85PNC?qs=349EhDEZ59rqeQxdKfSn5w%3D%3D; Arrow Part Number: CL10B104KB85PNC; Arrow Price/Stock: https://www.arrow.com/en/products/cl10b104kb85pnc/samsung-electro-mechanics; ClassName: TEC3
C203 = CAP: as C200 on sheet TEC_CONTROLLER_1; Package_Size: 0603; Package_Type: SMD; Tolerance: 10%; PCB DECAL: CC0603N; ClassName: TEC3
C205 = CAP: as C210 on sheet TEC_CONTROLLER_1; Tolerance: 10%; Dielectric_Type: X5R; Package_Size: 0603; PCB DECAL: CC0603N; ClassName: TEC3
C214 C217 C220 C225 C226 C230 C233 = CL10B105KB8NQNC: Capacitor; Manufacturer_Name: SAMSUNG; Datasheet Link: https://product.samsungsem.com/mlcc/CL10B105KB8NQN.do; Height: 0.95mm; Manufacturer_Part_Number: CL10B105KB8NQNC; Mouser Part Number: 187-CL10B105KB8NQNC; Mouser Price/Stock: https://www.mouser.co.uk/ProductDetail/Samsung-Electro-Mechanics/CL10B105KB8NQNC?qs=Jm2GQyTW%2FbjBq1uiSyA2AQ%3D%3D; Arrow Part Number: CL10B105KB8NQNC; Arrow Price/Stock: https://www.arrow.com/en/products/cl10b105kb8nqnc/samsung-electro-mechanics?region=europe; ClassName: TEC3
J65 J66 = CON02: as J69 on sheet TEC_CONTROLLER_1; PCB DECAL: AE-6410-2W-VERTICAL; Part No: 22-29-2021; ClassName: TEC3
  J66: System: Connector
L7 L8 = CDRH6D38NP-3R3NC: Inductor; Manufacturer_Name: Sumida; Datasheet Link: http://products.sumida.com/products/pdf/CDRH6D38.pdf; Manufacturer_Part_Number: CDRH6D38NP-3R3NC; Mouser Part Number: 851-CDRH6D38NP-3R3NC; Mouser Price/Stock: https://www.mouser.co.uk/ProductDetail/Sumida/CDRH6D38NP-3R3NC?qs=yEEOfDmvQDXre4MvBRE7jQ%3D%3D; Arrow Part Number: CDRH6D38NP-3R3NC; Arrow Price/Stock: https://www.arrow.com/en/products/cdrh6d38np-3R3nc/sumida?region=nac; Height: 4mm
NT3 = NetTie: as NT2 on sheet TEC_CONTROLLER_1; Package_Size: 0603
R212 R235 R243 = CR0603-JW-103ELF: Resistor; Manufacturer_Name: Bourns; Datasheet Link: https://www.bourns.com/pdfs/chpreztr.pdf; Height: 0.55mm; Manufacturer_Part_Number: CR0603-JW-103ELF; Mouser Part Number: 652-CR0603-JW-103ELF; Mouser Price/Stock: https://www.mouser.co.uk/ProductDetail/Bourns/CR0603-JW-103ELF?qs=tprK%2FdUq6q6vORSl%252Bpo4rg%3D%3D; Arrow Part Number: CR0603-JW-103ELF; Arrow Price/Stock: https://www.arrow.com/en/products/cr0603-jw-103elf/bourns?utm_currency=USD&region=nac
R215 = RES: as R217 on sheet TEC_CONTROLLER_1; PCB DECAL: CR0603N; Rated_Power: 1/10W; Tolerance: 1%; Package_Size: 0603; Value: 240k; ClassName: TEC3
R220 R223 R242 R247 = RES: as R64 on sheet TEC_CONTROLLER_1; PCB DECAL: CR0603N; Rated_Power: 1/10W; Tolerance: 1%; Package_Size: 0603; Value: 100k; ClassName: TEC3
R227 = CMP-07231-004798-1: as R241 on sheet TEC_CONTROLLER_1; Number of Terminations: 2; Radiation Hardening: No; Features: Moisture Resistant; Military Standard: Not; Width: 0.031inch; Case Code (Imperial): 0603; Tolerance: 5%; Height: 0.022inch; Min Operating Temperature: -55°C; Packaging: Tape and Reel; Case Code (Metric): 1608; Contact Plating: Tin; Mount: Surface Mount; Max Operating Temperature: 155°C; Length: 1.6mm; Temperature Coefficient: 200ppm/°C; Power Rating: 100mW; Depth: 0.8mm; Termination: SMD/SMT; Composition: Thick Film; Package Quantity: 5000; Thickness: 457um; Case/Package: 0603
R228 R237 = RES: as R186 on sheet TEC_CONTROLLER_1; PCB DECAL: CR0603N; Rated_Power: 1/10W; Tolerance: 1%; Package_Size: 0603; ClassName: TEC3
R233 = RES: as R222 on sheet TEC_CONTROLLER_1; PCB DECAL: CR0603N; Rated_Power: 1/10W; Tolerance: 1%; Package_Size: 0603; Value: 40k; ClassName: TEC3
R252 = PE1206FRE470R05L: Resistor; Manufacturer_Name: YAGEO; Datasheet Link: https://www.yageo.com/upload/media/product/productsearch/datasheet/rchip/PYu-PE_521_RoHS_L_10.pdf; Height: 0.89mm; Manufacturer_Part_Number: PE1206FRE470R05L; Mouser Part Number: 603-PE1206FRE470R05L; Mouser Price/Stock: https://www.mouser.co.uk/ProductDetail/YAGEO/PE1206FRE470R05L?qs=eP2BKZSCXI5fQbfM3JSqUA%3D%3D
TP2 = MILLMAX3210: as TP1 on sheet TEC_CONTROLLER_2; PCB DECAL: MILLMAX3210; ClassName: TEC3
U66 U72 = MAX4477: as U67 on sheet TEC_CONTROLLER_1; PCB DECAL: SOP65P490X110-8CN; ClassName: TEC3
U73 = MAX1968: as U75 on sheet TEC_CONTROLLER_1; PCB DECAL: SOP65P638X110-29N; ClassName: TEC3

## Sheet TX_FlexiConnectors.SchDoc: Laser PCB
size A3; DrawnBy: James Singleton; Organization: TMC Technology Ltd.; DocumentNumber: 9; Revision: A; SheetNumber: 13; SheetTotal: 18; Drawn Date: 22/12/2020
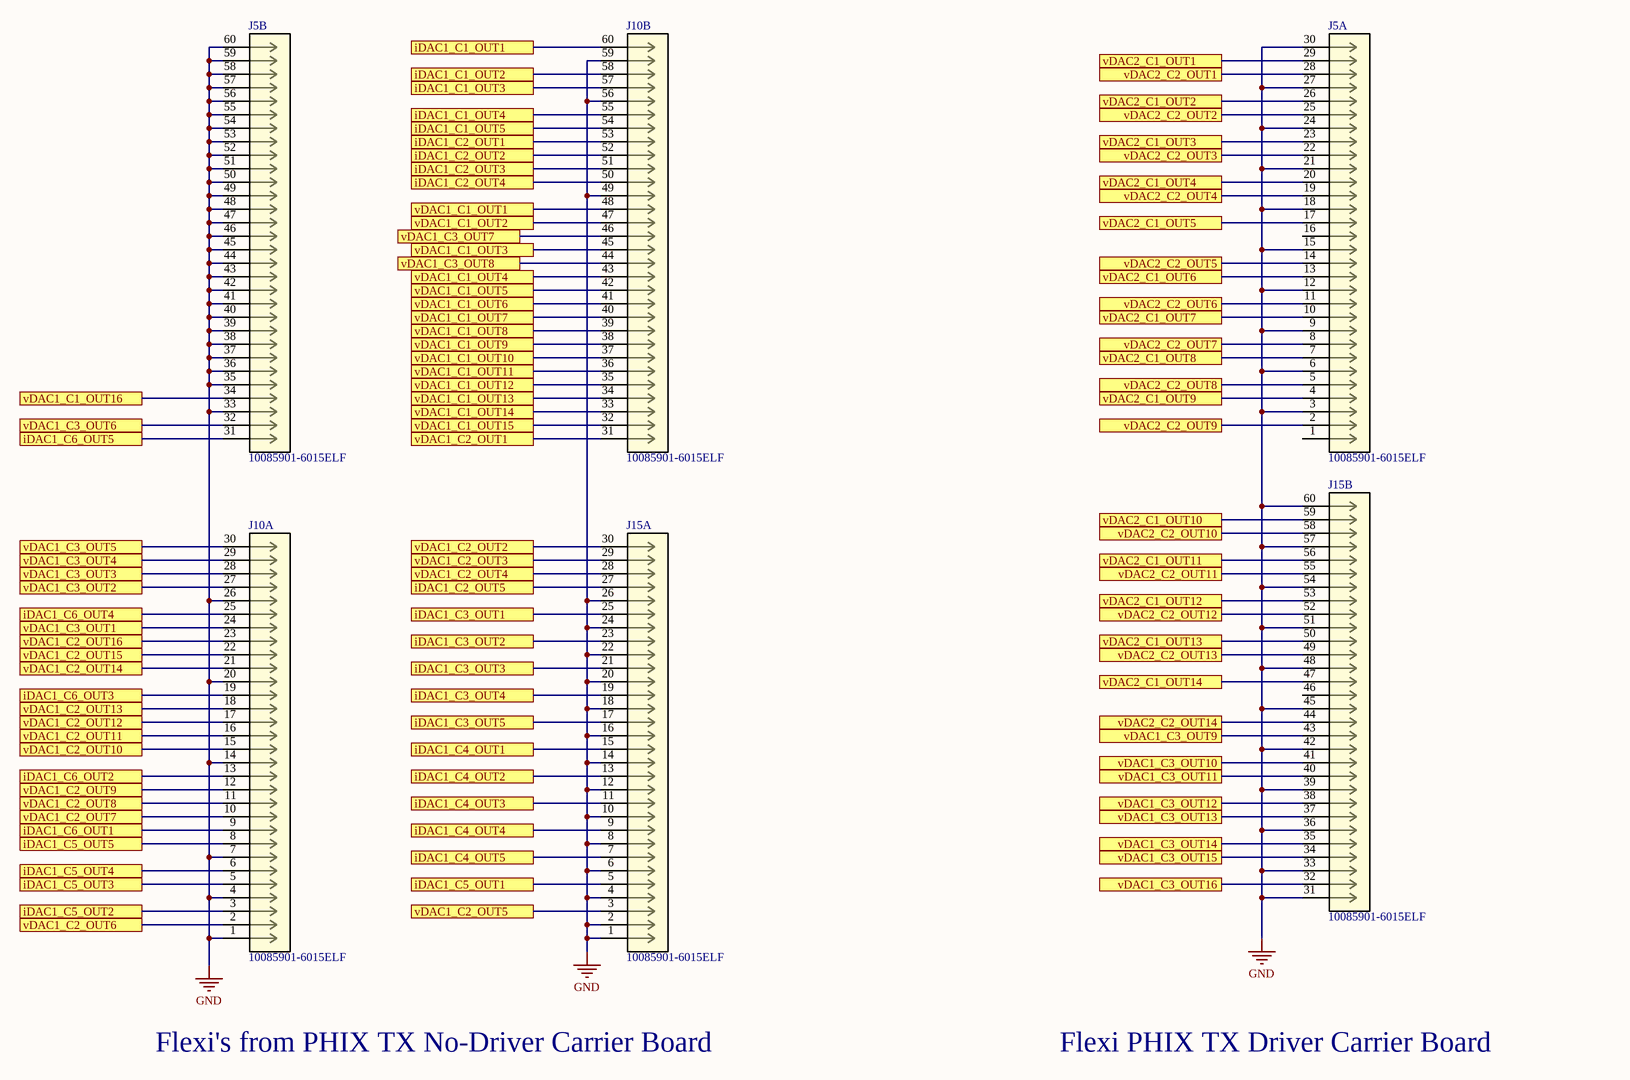
[diagram p17: TX_FlexiConnectors.SchDoc]

### Parts
J5  10085901-6015ELF  [CONN_10085901-6015ELF_AMP]  (parts A,B of 2)
J10  10085901-6015ELF  [CONN_10085901-6015ELF_AMP]  (parts A,B of 2)
J15  10085901-6015ELF  [CONN_10085901-6015ELF_AMP]  (parts A,B of 2)

### Ports
iDAC1_C1_OUT1 (see iDAC1[4A]), iDAC1_C1_OUT2 (see iDAC1[4A]), iDAC1_C1_OUT3 (see iDAC1[4A]), iDAC1_C1_OUT4 (see iDAC1[4A]), iDAC1_C1_OUT5 (see iDAC1[4A]), iDAC1_C2_OUT1 (see iDAC1[4A]), iDAC1_C2_OUT2 (see iDAC1[4A]), iDAC1_C2_OUT3 (see iDAC1[4A]), iDAC1_C2_OUT4 (see iDAC1[4A]), iDAC1_C2_OUT5 (see iDAC1[4A]), iDAC1_C3_OUT1 (see iDAC1[4B]), iDAC1_C3_OUT2 (see iDAC1[4B]), iDAC1_C3_OUT3 (see iDAC1[4B]), iDAC1_C3_OUT4 (see iDAC1[4B]), iDAC1_C3_OUT5 (see iDAC1[4B]), iDAC1_C4_OUT1 (see iDAC1[4B]), iDAC1_C4_OUT2 (see iDAC1[4B]), iDAC1_C4_OUT3 (see iDAC1[4B]), iDAC1_C4_OUT4 (see iDAC1[4B]), iDAC1_C4_OUT5 (see iDAC1[4B]), iDAC1_C5_OUT1 (see iDAC1[4C]), iDAC1_C5_OUT2 (see iDAC1[4C]), iDAC1_C5_OUT3 (see iDAC1[4C]), iDAC1_C5_OUT4 (see iDAC1[4C]), iDAC1_C5_OUT5 (see iDAC1[4C]), iDAC1_C6_OUT1 (see iDAC1[6A]), iDAC1_C6_OUT2 (see iDAC1[6A]), iDAC1_C6_OUT3 (see iDAC1[6A]), iDAC1_C6_OUT4 (see iDAC1[6A]), iDAC1_C6_OUT5 (see iDAC1[6A]), vDAC1_C1_OUT1 (see vDAC1[3A]), vDAC1_C1_OUT2 (see vDAC1[3B]), vDAC1_C1_OUT3 (see vDAC1[3B]), vDAC1_C1_OUT4 (see vDAC1[3B]), vDAC1_C1_OUT5 (see vDAC1[3B]), vDAC1_C1_OUT6 (see vDAC1[3B]), vDAC1_C1_OUT7 (see vDAC1[3B]), vDAC1_C1_OUT8 (see vDAC1[3B]), vDAC1_C1_OUT9 (see vDAC1[3B]), vDAC1_C1_OUT10 (see vDAC1[3B]), vDAC1_C1_OUT11 (see vDAC1[3B]), vDAC1_C1_OUT12 (see vDAC1[3B]), vDAC1_C1_OUT13 (see vDAC1[3B]), vDAC1_C1_OUT14 (see vDAC1[3B]), vDAC1_C1_OUT15 (see vDAC1[3B], vDAC1[5D]), vDAC1_C1_OUT16 (see vDAC1[3B], vDAC1[5D]), vDAC1_C2_OUT1 (see vDAC1[5A]), vDAC1_C2_OUT2 (see vDAC1[5B]), vDAC1_C2_OUT3 (see vDAC1[5B]), vDAC1_C2_OUT4 (see vDAC1[5B]), vDAC1_C2_OUT5 (see vDAC1[5B]), vDAC1_C2_OUT6 (see vDAC1[5B]), vDAC1_C2_OUT7 (see vDAC1[5B]), vDAC1_C2_OUT8 (see vDAC1[5B]), vDAC1_C2_OUT9 (see vDAC1[5B]), vDAC1_C2_OUT10 (see vDAC1[5B]), vDAC1_C2_OUT11 (see vDAC1[5B]), vDAC1_C2_OUT12 (see vDAC1[5B]), vDAC1_C2_OUT13 (see vDAC1[5B]), vDAC1_C2_OUT14 (see vDAC1[5B]), vDAC1_C2_OUT15 (see vDAC1[5B]), vDAC1_C2_OUT16 (see vDAC1[5B]), vDAC1_C3_OUT1 (see vDAC1[3C]), vDAC1_C3_OUT2 (see vDAC1[3C]), vDAC1_C3_OUT3 (see vDAC1[3C]), vDAC1_C3_OUT4 (see vDAC1[3C]), vDAC1_C3_OUT5 (see vDAC1[3C]), vDAC1_C3_OUT6 (see vDAC1[5C]), vDAC1_C3_OUT7 (see vDAC1[5C]), vDAC1_C3_OUT8 (see vDAC1[5C]), vDAC1_C3_OUT9 (see vDAC1[5C]), vDAC1_C3_OUT10 (see vDAC1[5C]), vDAC1_C3_OUT11 (see vDAC1[5C]), vDAC1_C3_OUT12 (see vDAC1[5C]), vDAC1_C3_OUT13 (see vDAC1[5C]), vDAC1_C3_OUT14 (see vDAC1[5C]), vDAC1_C3_OUT15 (see vDAC1[5C]), vDAC1_C3_OUT16 (see vDAC1[5C]), vDAC2_C1_OUT1 (see vDAC2[3A]), vDAC2_C1_OUT2 (see vDAC2[3B]), vDAC2_C1_OUT3 (see vDAC2[3B]), vDAC2_C1_OUT4 (see vDAC2[3B]), vDAC2_C1_OUT5 (see vDAC2[3B]), vDAC2_C1_OUT6 (see vDAC2[3B]), vDAC2_C1_OUT7 (see vDAC2[3B]), vDAC2_C1_OUT8 (see vDAC2[3B]), vDAC2_C1_OUT9 (see vDAC2[3B]), vDAC2_C1_OUT10 (see vDAC2[3B]), vDAC2_C1_OUT11 (see vDAC2[3B]), vDAC2_C1_OUT12 (see vDAC2[3B]), vDAC2_C1_OUT13 (see vDAC2[3B]), vDAC2_C1_OUT14 (see vDAC2[3B]), vDAC2_C2_OUT1 (see vDAC2[5A]), vDAC2_C2_OUT2 (see vDAC2[5B]), vDAC2_C2_OUT3 (see vDAC2[5B]), vDAC2_C2_OUT4 (see vDAC2[5B]), vDAC2_C2_OUT5 (see vDAC2[5B]), vDAC2_C2_OUT6 (see vDAC2[5B]), vDAC2_C2_OUT7 (see vDAC2[5B]), vDAC2_C2_OUT8 (see vDAC2[5B]), vDAC2_C2_OUT9 (see vDAC2[5B]), vDAC2_C2_OUT10 (see vDAC2[5B]), vDAC2_C2_OUT11 (see vDAC2[5B]), vDAC2_C2_OUT12 (see vDAC2[5B]), vDAC2_C2_OUT13 (see vDAC2[5B]), vDAC2_C2_OUT14 (see vDAC2[5B])

### Nets
GND: J5.3 J5.6 J5.9 J5.12 J5.15 J5.18 J5.21 J5.24 J5.27 J5.30 J5.33 J5.35 J5.36 J5.37 J5.38 J5.39 J5.40 J5.41 J5.42 J5.43 J5.44 J5.45 J5.46 J5.47 J5.48 J5.49 J5.50 J5.51 J5.52 J5.53 J5.54 J5.55 J5.56 J5.57 J5.58 J5.59 J5.60 J10.1 J10.4 J10.7 J10.14 J10.20 J10.26 J10.49 J10.56 J10.59 J15.1 J15.2 J15.4 J15.6 J15.8 J15.10 J15.12 J15.14 J15.16 J15.18 J15.20 J15.22 J15.24 J15.26 J15.31 J15.33 J15.36 J15.39 J15.42 J15.45 J15.48 J15.51 J15.54 J15.57 J15.60
iDAC1_C1_OUT1: J10.60 ; port iDAC1_C1_OUT1
iDAC1_C1_OUT2: J10.58 ; port iDAC1_C1_OUT2
iDAC1_C1_OUT3: J10.57 ; port iDAC1_C1_OUT3
iDAC1_C1_OUT4: J10.55 ; port iDAC1_C1_OUT4
iDAC1_C1_OUT5: J10.54 ; port iDAC1_C1_OUT5
iDAC1_C2_OUT1: J10.53 ; port iDAC1_C2_OUT1
iDAC1_C2_OUT2: J10.52 ; port iDAC1_C2_OUT2
iDAC1_C2_OUT3: J10.51 ; port iDAC1_C2_OUT3
iDAC1_C2_OUT4: J10.50 ; port iDAC1_C2_OUT4
iDAC1_C2_OUT5: J15.27 ; port iDAC1_C2_OUT5
iDAC1_C3_OUT1: J15.25 ; port iDAC1_C3_OUT1
iDAC1_C3_OUT2: J15.23 ; port iDAC1_C3_OUT2
iDAC1_C3_OUT3: J15.21 ; port iDAC1_C3_OUT3
iDAC1_C3_OUT4: J15.19 ; port iDAC1_C3_OUT4
iDAC1_C3_OUT5: J15.17 ; port iDAC1_C3_OUT5
iDAC1_C4_OUT1: J15.15 ; port iDAC1_C4_OUT1
iDAC1_C4_OUT2: J15.13 ; port iDAC1_C4_OUT2
iDAC1_C4_OUT3: J15.11 ; port iDAC1_C4_OUT3
iDAC1_C4_OUT4: J15.9 ; port iDAC1_C4_OUT4
iDAC1_C4_OUT5: J15.7 ; port iDAC1_C4_OUT5
iDAC1_C5_OUT1: J15.5 ; port iDAC1_C5_OUT1
iDAC1_C5_OUT2: J10.3 ; port iDAC1_C5_OUT2
iDAC1_C5_OUT3: J10.5 ; port iDAC1_C5_OUT3
iDAC1_C5_OUT4: J10.6 ; port iDAC1_C5_OUT4
iDAC1_C5_OUT5: J10.8 ; port iDAC1_C5_OUT5
iDAC1_C6_OUT1: J10.9 ; port iDAC1_C6_OUT1
iDAC1_C6_OUT2: J10.13 ; port iDAC1_C6_OUT2
iDAC1_C6_OUT3: J10.19 ; port iDAC1_C6_OUT3
iDAC1_C6_OUT4: J10.25 ; port iDAC1_C6_OUT4
iDAC1_C6_OUT5: J5.31 ; port iDAC1_C6_OUT5
vDAC1_C1_OUT1: J10.48 ; port vDAC1_C1_OUT1
vDAC1_C1_OUT2: J10.47 ; port vDAC1_C1_OUT2
vDAC1_C1_OUT3: J10.45 ; port vDAC1_C1_OUT3
vDAC1_C1_OUT4: J10.43 ; port vDAC1_C1_OUT4
vDAC1_C1_OUT5: J10.42 ; port vDAC1_C1_OUT5
vDAC1_C1_OUT6: J10.41 ; port vDAC1_C1_OUT6
vDAC1_C1_OUT7: J10.40 ; port vDAC1_C1_OUT7
vDAC1_C1_OUT8: J10.39 ; port vDAC1_C1_OUT8
vDAC1_C1_OUT9: J10.38 ; port vDAC1_C1_OUT9
vDAC1_C1_OUT10: J10.37 ; port vDAC1_C1_OUT10
vDAC1_C1_OUT11: J10.36 ; port vDAC1_C1_OUT11
vDAC1_C1_OUT12: J10.35 ; port vDAC1_C1_OUT12
vDAC1_C1_OUT13: J10.34 ; port vDAC1_C1_OUT13
vDAC1_C1_OUT14: J10.33 ; port vDAC1_C1_OUT14
vDAC1_C1_OUT15: J10.32 ; port vDAC1_C1_OUT15
vDAC1_C1_OUT16: J5.34 ; port vDAC1_C1_OUT16
vDAC1_C2_OUT1: J10.31 ; port vDAC1_C2_OUT1
vDAC1_C2_OUT2: J15.30 ; port vDAC1_C2_OUT2
vDAC1_C2_OUT3: J15.29 ; port vDAC1_C2_OUT3
vDAC1_C2_OUT4: J15.28 ; port vDAC1_C2_OUT4
vDAC1_C2_OUT5: J15.3 ; port vDAC1_C2_OUT5
vDAC1_C2_OUT6: J10.2 ; port vDAC1_C2_OUT6
vDAC1_C2_OUT7: J10.10 ; port vDAC1_C2_OUT7
vDAC1_C2_OUT8: J10.11 ; port vDAC1_C2_OUT8
vDAC1_C2_OUT9: J10.12 ; port vDAC1_C2_OUT9
vDAC1_C2_OUT10: J10.15 ; port vDAC1_C2_OUT10
vDAC1_C2_OUT11: J10.16 ; port vDAC1_C2_OUT11
vDAC1_C2_OUT12: J10.17 ; port vDAC1_C2_OUT12
vDAC1_C2_OUT13: J10.18 ; port vDAC1_C2_OUT13
vDAC1_C2_OUT14: J10.21 ; port vDAC1_C2_OUT14
vDAC1_C2_OUT15: J10.22 ; port vDAC1_C2_OUT15
vDAC1_C2_OUT16: J10.23 ; port vDAC1_C2_OUT16
vDAC1_C3_OUT1: J10.24 ; port vDAC1_C3_OUT1
vDAC1_C3_OUT2: J10.27 ; port vDAC1_C3_OUT2
vDAC1_C3_OUT3: J10.28 ; port vDAC1_C3_OUT3
vDAC1_C3_OUT4: J10.29 ; port vDAC1_C3_OUT4
vDAC1_C3_OUT5: J10.30 ; port vDAC1_C3_OUT5
vDAC1_C3_OUT6: J5.32 ; port vDAC1_C3_OUT6
vDAC1_C3_OUT7: J10.46 ; port vDAC1_C3_OUT7
vDAC1_C3_OUT8: J10.44 ; port vDAC1_C3_OUT8
vDAC1_C3_OUT9: J15.43 ; port vDAC1_C3_OUT9
vDAC1_C3_OUT10: J15.41 ; port vDAC1_C3_OUT10
vDAC1_C3_OUT11: J15.40 ; port vDAC1_C3_OUT11
vDAC1_C3_OUT12: J15.38 ; port vDAC1_C3_OUT12
vDAC1_C3_OUT13: J15.37 ; port vDAC1_C3_OUT13
vDAC1_C3_OUT14: J15.35 ; port vDAC1_C3_OUT14
vDAC1_C3_OUT15: J15.34 ; port vDAC1_C3_OUT15
vDAC1_C3_OUT16: J15.32 ; port vDAC1_C3_OUT16
vDAC2_C1_OUT1: J5.29 ; port vDAC2_C1_OUT1
vDAC2_C1_OUT2: J5.26 ; port vDAC2_C1_OUT2
vDAC2_C1_OUT3: J5.23 ; port vDAC2_C1_OUT3
vDAC2_C1_OUT4: J5.20 ; port vDAC2_C1_OUT4
vDAC2_C1_OUT5: J5.17 ; port vDAC2_C1_OUT5
vDAC2_C1_OUT6: J5.13 ; port vDAC2_C1_OUT6
vDAC2_C1_OUT7: J5.10 ; port vDAC2_C1_OUT7
vDAC2_C1_OUT8: J5.7 ; port vDAC2_C1_OUT8
vDAC2_C1_OUT9: J5.4 ; port vDAC2_C1_OUT9
vDAC2_C1_OUT10: J15.59 ; port vDAC2_C1_OUT10
vDAC2_C1_OUT11: J15.56 ; port vDAC2_C1_OUT11
vDAC2_C1_OUT12: J15.53 ; port vDAC2_C1_OUT12
vDAC2_C1_OUT13: J15.50 ; port vDAC2_C1_OUT13
vDAC2_C1_OUT14: J15.47 ; port vDAC2_C1_OUT14
vDAC2_C2_OUT1: J5.28 ; port vDAC2_C2_OUT1
vDAC2_C2_OUT2: J5.25 ; port vDAC2_C2_OUT2
vDAC2_C2_OUT3: J5.22 ; port vDAC2_C2_OUT3
vDAC2_C2_OUT4: J5.19 ; port vDAC2_C2_OUT4
vDAC2_C2_OUT5: J5.14 ; port vDAC2_C2_OUT5
vDAC2_C2_OUT6: J5.11 ; port vDAC2_C2_OUT6
vDAC2_C2_OUT7: J5.8 ; port vDAC2_C2_OUT7
vDAC2_C2_OUT8: J5.5 ; port vDAC2_C2_OUT8
vDAC2_C2_OUT9: J5.2 ; port vDAC2_C2_OUT9
vDAC2_C2_OUT10: J15.58 ; port vDAC2_C2_OUT10
vDAC2_C2_OUT11: J15.55 ; port vDAC2_C2_OUT11
vDAC2_C2_OUT12: J15.52 ; port vDAC2_C2_OUT12
vDAC2_C2_OUT13: J15.49 ; port vDAC2_C2_OUT13
vDAC2_C2_OUT14: J15.44 ; port vDAC2_C2_OUT14

Not connected (* = marked no-connect by the designer): J5 1 16; J15 46

### Notes on the sheet
- Flexi's from PHIX TX No-Driver Carrier Board
- Flexi PHIX TX Driver Carrier Board
- TMC Technology Ltd.
- Page Contents:
- Project:
- Variant:
- Checked By:
- Size:
- Date:
- Dwg No:
- Sheet
- of
- Revision:

### Library data of the parts
J5 J10 J15 = 10085901-6015ELF: No Description Available; Vendor: Amphenol; Built_By: EMA_Cory; SourceLibrary: Add_to_database_2021-04-09; System: Connector; Datasheet: https://cdn.amphenol-icc.com/media/wysiwyg/files/drawing/10085901.pdf?__cf_chl_jschl_tk__=00cf1f2338c5aeb40a4a47e00234174ceeaf26be-1617915708-0-AUipvdsWCe-XZcdQlp4wT1nonxNIPUZLiwIArEoPaP6cuSg2Amwfh3IakaG5lV7f92VjraYq1c-sb0kWBpxlvqJ5btwK7xgzNsdYdPmM7_nb70OsPjyWttq9HPXjGplazXSr1hDHv_rDyC0zqv3HN48lPyOnNuBENjkL6MLTjp3uNt_7zdD9wXF42vBbOCWCMT21rEgRTcG02oyZPRtIZwSo4Bm14CHkq-wdTg3hTL-ge00hJNPLNIP2JOl_bFxROehCM3O6jFy1LURflg9URMEHmwnyPbKOGS5_efv-ux4kMXut2MrrVkPCOaNyQI6A4DXSEQB6NjyE-YiRBZyhp3AdQLNym8hlKD61FdGHWwHwPR-a6VgqUZ92M4HgAmiZit1aB5L5iBGO44LNzjKKX60f2YBLURA21HBfVl5evVMz2Eb-ABe8B7xej-rMAyqLj9p7F-6ASMxfQEpk_K_En3gheYDfZcXem0ttM-lU-86L; Manufacturer_Part_Number: 10085901-6015ELF; Copyright: Copyright (C) 2018 Accelerated Designs. All rights reserved; RefDes: RefDes; Type: DEV